# Altium project AMDC.PrjPCB (part 1 of 4)
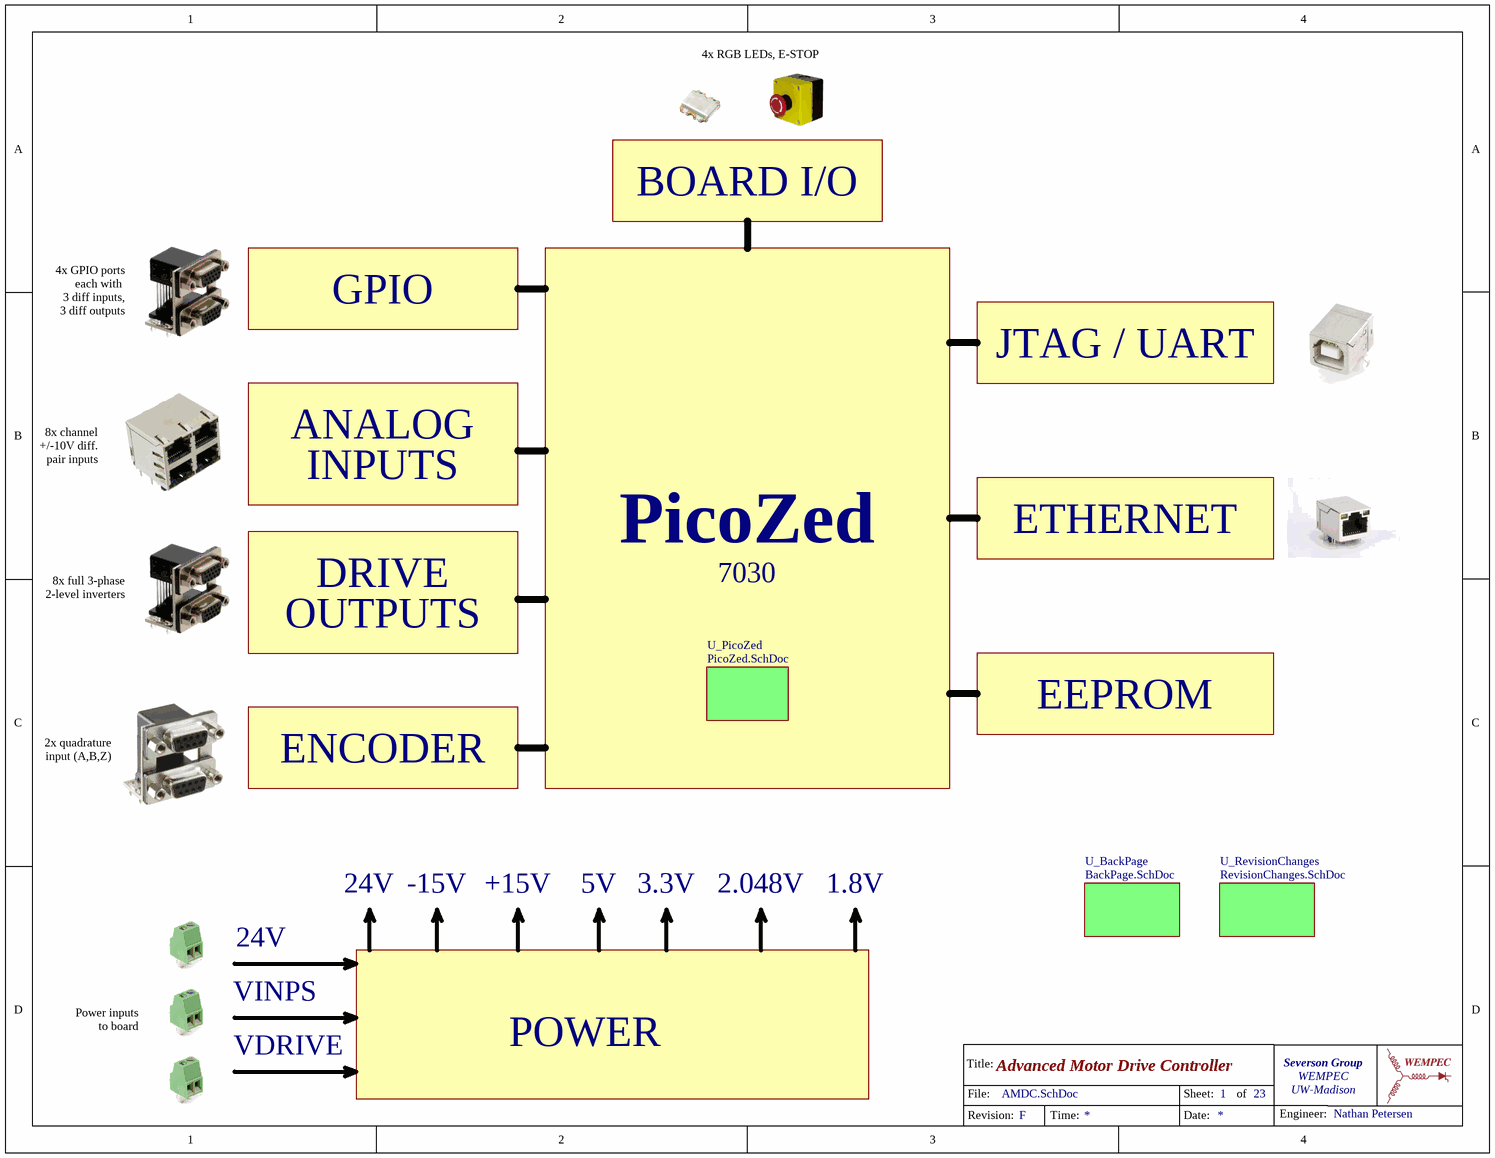
[diagram p0: AMDC.SchDoc]
ProjectGroup: Severson Group; ProjectOrganization: WEMPEC; ProjectRev: F; ProjectUniversity: UW-Madison
23 sheets, 519 parts. Net scope: hierarchical (ports join the sheet entries above them; power ports are global).
Board files: PCB_v4.PcbDoc, PCB_v5.PcbDoc, PCB_v6.PcbDoc
Sheets:
  AMDC.SchDoc
    U_PicoZed = PicoZed.SchDoc
      U_DriveInterface = DriveInterface.SchDoc
        U_InverterConnectors = InverterConnectors.SchDoc
          InverterConnector1AB = InverterConnector.SchDoc
          InverterConnector2AB = InverterConnector.SchDoc
          InverterConnector3AB = InverterConnector.SchDoc
          InverterConnector4AB = InverterConnector.SchDoc
        U_InverterTranslation = InverterTranslation.SchDoc
          U_LVHV8ChanTranslation1 = LVHV8ChanTranslation.SchDoc
          U_LVHV8ChanTranslation2 = LVHV8ChanTranslation.SchDoc
          U_LVHV8ChanTranslation3 = LVHV8ChanTranslation.SchDoc
          U_LVHV8ChanTranslation4 = LVHV8ChanTranslation.SchDoc
          U_LVHV8ChanTranslation5 = LVHV8ChanTranslation.SchDoc
          U_LVHV8ChanTranslation6 = LVHV8ChanTranslation.SchDoc
          U_TranslationStsA = TranslationDir8Chan.SchDoc
          U_TranslationStsB = TranslationDir8Chan.SchDoc
          U_TranslationStsC = TranslationDir8Chan.SchDoc
          U_TranslationStsD = TranslationDir8Chan.SchDoc
      U_AnalogInterface = AnalogInterface.SchDoc
        U_AnalogADC = AnalogADCs.SchDoc
        U_AnalogConnectors = AnalogConnectors.SchDoc
        U_AnalogConditioning = AnalogConditioning.SchDoc
          AnalogSigCond_A = AnalogSigCond.SchDoc
          AnalogSigCond_B = AnalogSigCond.SchDoc
      U_Gb_Ethernet = GbEthernet.SchDoc
      U_Encoder = Encoder.SchDoc
      U_BoardIO = BoardIO.SchDoc
      U_Power = Power.SchDoc
        U_Power_Protection = Power_Protection.SchDoc
        U_Power_InrushLimit = Power_InrushLimit.SchDoc
      U_JTAG_UART = JTAG_UART.SchDoc
      U_GPIO = GPIO.SchDoc
        U_TranslationGPIO_IN_A = TranslationDir8Chan.SchDoc
        U_TranslationGPIO_OUT_A = TranslationDir8Chan.SchDoc
        U_TranslationGPIO_IN_B = TranslationDir8Chan.SchDoc
        U_TranslationGPIO_OUT_B = TranslationDir8Chan.SchDoc
    U_BackPage = BackPage.SchDoc
    U_RevisionChanges = RevisionChanges.SchDoc

## Sheet AMDC.SchDoc: Advanced Motor Drive Controller
size Letter; Engineer: Nathan Petersen; DocumentNumber: 1; Revision: v1.2; SheetNumber: 1; SheetTotal: 23

### Sub-sheets
U_BackPage = BackPage.SchDoc: no entries
U_PicoZed = PicoZed.SchDoc: no entries
U_RevisionChanges = RevisionChanges.SchDoc: no entries

### Notes on the sheet
- 4x RGB LEDs, E-STOP
- BOARD I/O
- GPIO
- 4x GPIO ports
  each with
  3 diff inputs,
  3 diff outputs
- JTAG / UART
- ANALOG
- 8x channel
  +/-10V diff.
  pair inputs
- INPUTS
- DRIVE
- PicoZed
- 7030
- ETHERNET
- 8x full 3-phase
  2-level inverters
- OUTPUTS
- EEPROM
- 2x quadrature
  input (A,B,Z)
- ENCODER
- 24V
- -15V
- +15V
- 5V
- 3.3V
- 2.048V
- 1.8V
- Power inputs
  to board
- VINPS
- VDRIVE
- POWER
- Title:
- File:
- Sheet:
- of
- Revision:
- Time:
- Date:
- Engineer:

## Sheet PicoZed.SchDoc: PicoZed Interface
size 431 x 254 mm; DrawnBy: Nathan Petersen; Engineer: Nathan Petersen; DocumentNumber: 2; Revision: v1.2; SheetNumber: 2; SheetTotal: 23
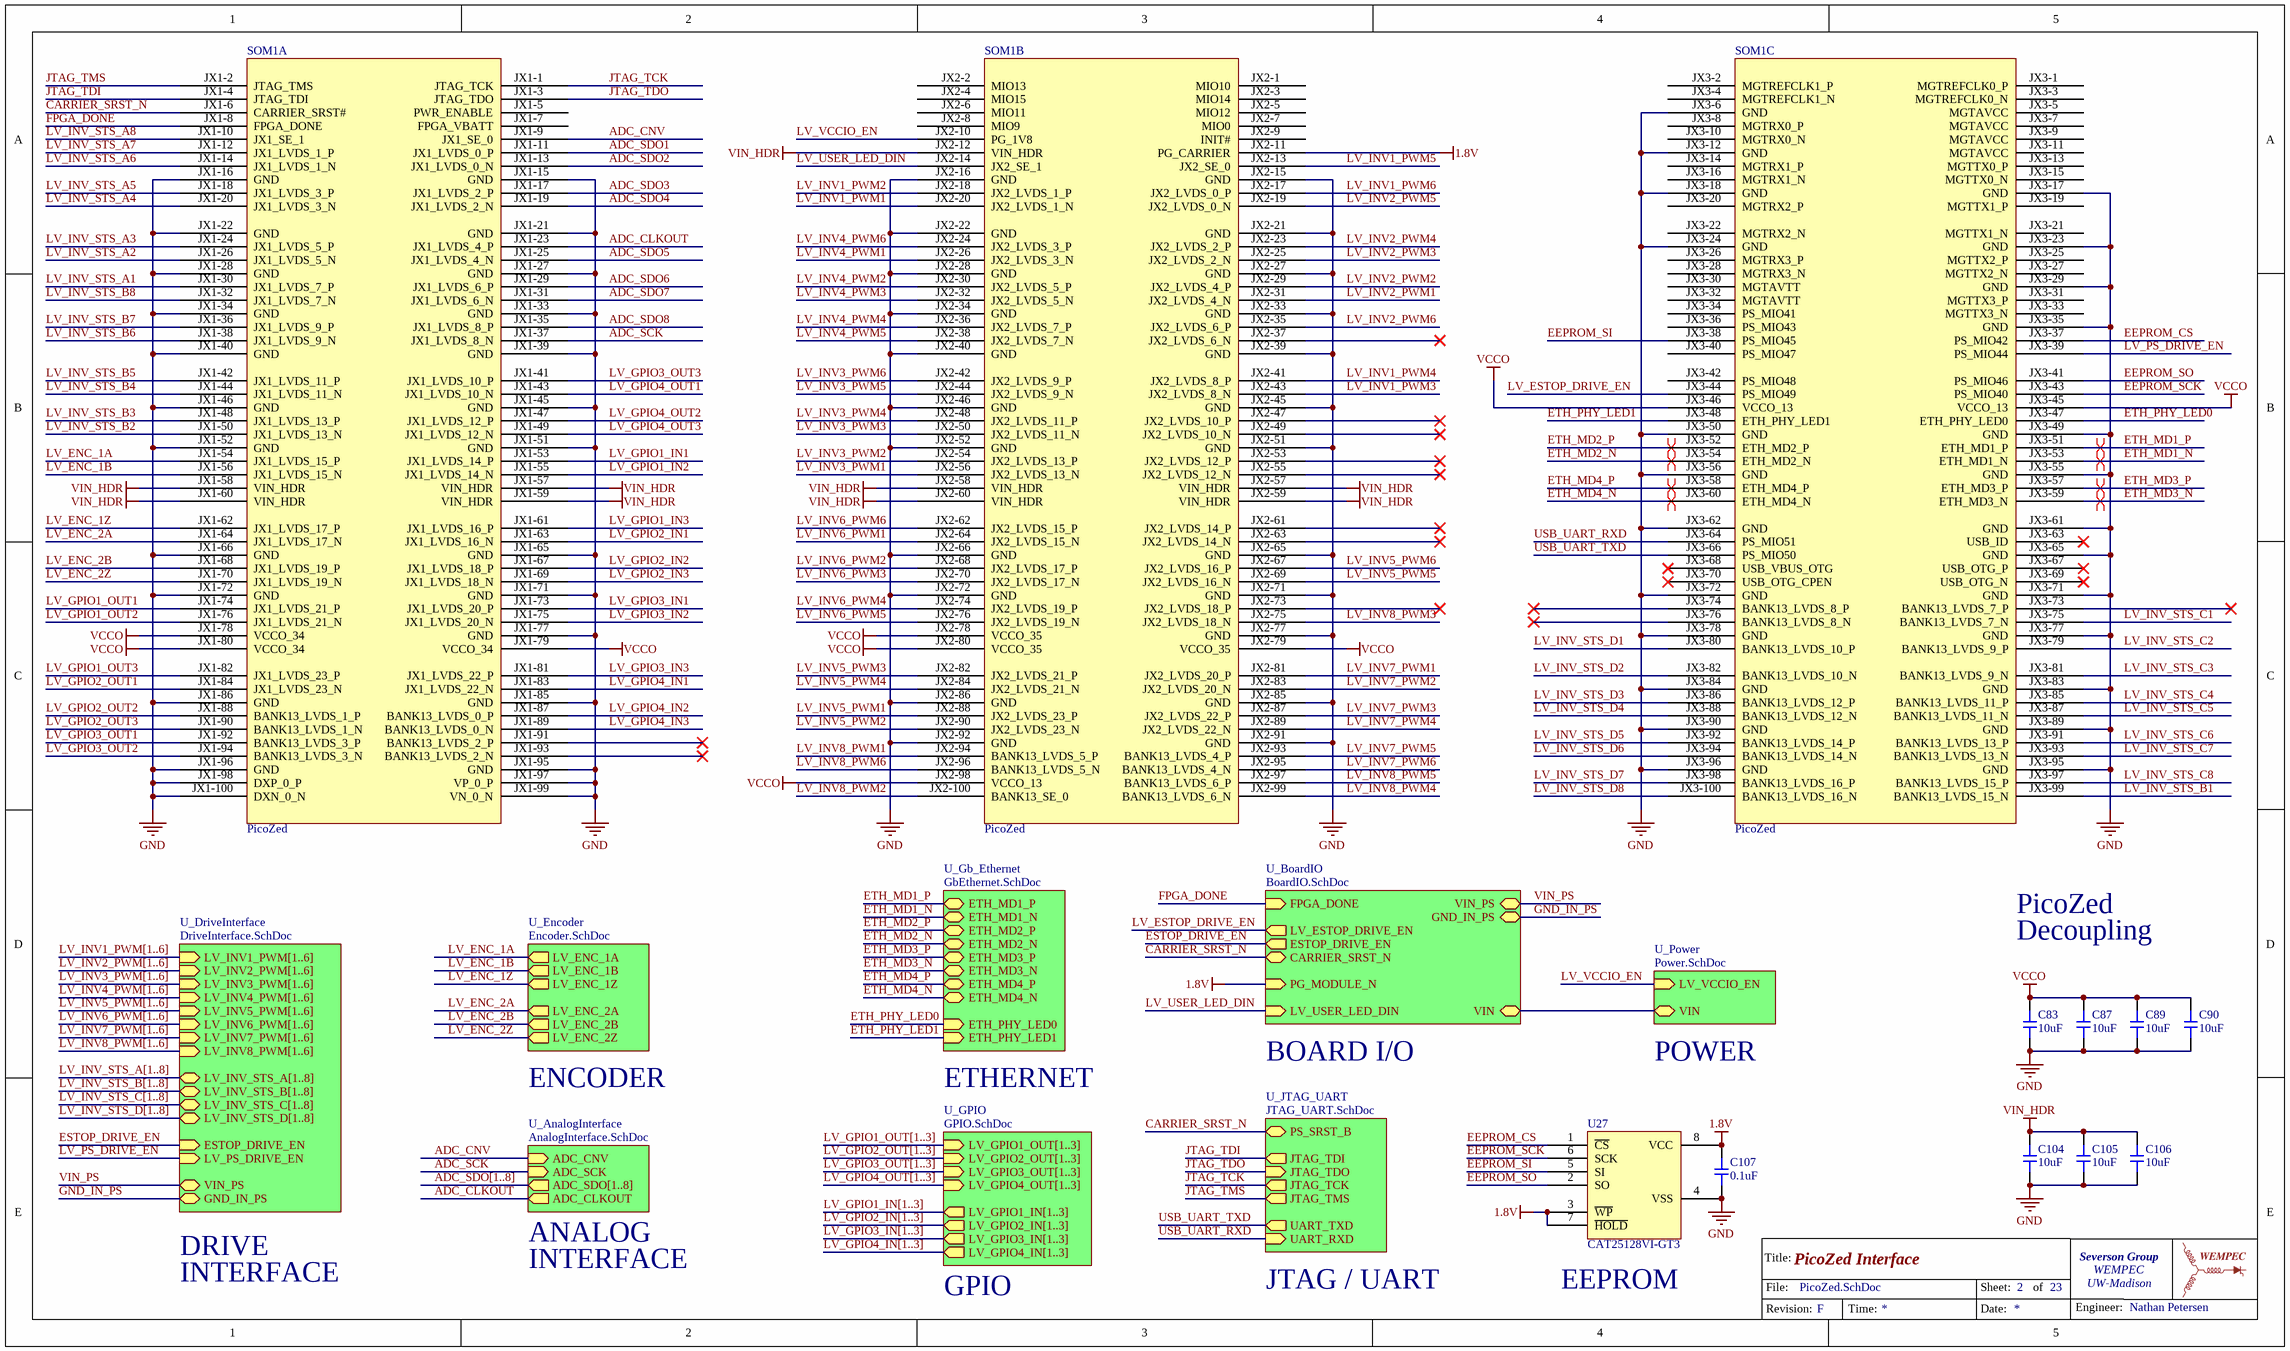
[diagram p1: PicoZed.SchDoc]

### Parts
*  TitleBlockWEMPEC  (value not drawn)  (graphical)
C83  value 10uF  [0603-CAP]  (hidden comment: Capacitor)
C87  value 10uF  [0603-CAP]  (hidden comment: Capacitor)
C89  value 10uF  [0603-CAP]  (hidden comment: Capacitor)
C90  value 10uF  [0603-CAP]  (hidden comment: Capacitor)
C104  value 10uF  [0603-CAP]  (hidden comment: Capacitor)
C105  value 10uF  [0603-CAP]  (hidden comment: Capacitor)
C106  value 10uF  [0603-CAP]  (hidden comment: Capacitor)
C107  value 0.1uF  [0603-CAP]  (hidden comment: Capacitor)
SOM1  PicoZed  [PicoZedSOM]  (parts A,B,C of 3)  (no BOM)
U27  CAT25128VI-GT3  [SOIC127P600X175-8N]

### Sub-sheets
U_AnalogInterface = AnalogInterface.SchDoc: ADC_SDO[1..8] (out), ADC_CNV (in), ADC_SCK (in), ADC_CLKOUT (out)
U_BoardIO = BoardIO.SchDoc: FPGA_DONE (in), ESTOP_DRIVE_EN (out), CARRIER_SRST_N (bidir), PG_MODULE_N (in), LV_USER_LED_DIN (in), LV_ESTOP_DRIVE_EN (out), GND_IN_PS (bidir), VIN_PS (bidir), VIN (bidir)
U_DriveInterface = DriveInterface.SchDoc: LV_INV2_PWM[1..6] (in), LV_INV3_PWM[1..6] (in), LV_INV4_PWM[1..6] (in), LV_INV5_PWM[1..6] (in), LV_INV6_PWM[1..6] (in), LV_INV7_PWM[1..6] (in), LV_INV8_PWM[1..6] (in), LV_INV1_PWM[1..6] (in), ESTOP_DRIVE_EN (in), LV_INV_STS_A[1..8] (bidir), LV_INV_STS_D[1..8] (bidir), LV_INV_STS_C[1..8] (bidir), LV_INV_STS_B[1..8] (bidir), LV_PS_DRIVE_EN (in), GND_IN_PS (bidir), VIN_PS (bidir)
U_Encoder = Encoder.SchDoc: LV_ENC_1A (out), LV_ENC_1B (out), LV_ENC_1Z (out), LV_ENC_2A (out), LV_ENC_2B (out), LV_ENC_2Z (out)
U_Gb_Ethernet = GbEthernet.SchDoc: ETH_MD1_P (bidir), ETH_MD1_N (bidir), ETH_MD2_P (bidir), ETH_MD2_N (bidir), ETH_MD3_P (bidir), ETH_MD3_N (bidir), ETH_MD4_P (bidir), ETH_MD4_N (bidir), ETH_PHY_LED0 (in), ETH_PHY_LED1 (in)
U_GPIO = GPIO.SchDoc: LV_GPIO4_OUT[1..3] (in), LV_GPIO3_OUT[1..3] (in), LV_GPIO1_OUT[1..3] (in), LV_GPIO3_IN[1..3] (out), LV_GPIO2_OUT[1..3] (in), LV_GPIO1_IN[1..3] (out), LV_GPIO2_IN[1..3] (out), LV_GPIO4_IN[1..3] (out)
U_JTAG_UART = JTAG_UART.SchDoc: JTAG_TMS (out), UART_TXD (out), PS_SRST_B (bidir), UART_RXD (in), JTAG_TDI (out), JTAG_TCK (out), JTAG_TDO (in)
U_Power = Power.SchDoc: VIN (bidir), LV_VCCIO_EN (in)

### Nets
1.8V: C107.2 SOM1.JX2-11(PG_CARRIER) U27.3(~{WP}) U27.7(~{HOLD}) U27.8(VCC) ; sheet U_BoardIO/PG_MODULE_N
GND: C83.1 C87.1 C89.1 C90.1 C104.1 C105.1 C106.1 C107.1 SOM1.JX1-15(GND) SOM1.JX1-16(GND) SOM1.JX1-21(GND) SOM1.JX1-22(GND) SOM1.JX1-27(GND) SOM1.JX1-28(GND) SOM1.JX1-33(GND) SOM1.JX1-34(GND) SOM1.JX1-39(GND) SOM1.JX1-40(GND) SOM1.JX1-45(GND) SOM1.JX1-46(GND) SOM1.JX1-51(GND) SOM1.JX1-52(GND) SOM1.JX1-65(GND) SOM1.JX1-66(GND) SOM1.JX1-71(GND) SOM1.JX1-72(GND) SOM1.JX1-77(GND) SOM1.JX1-85(GND) SOM1.JX1-86(GND) SOM1.JX1-95(GND) SOM1.JX1-96(GND) SOM1.JX1-97(VP_0_P) SOM1.JX1-98(DXP_0_P) SOM1.JX1-99(VN_0_N) SOM1.JX1-100(DXN_0_N) SOM1.JX2-15(GND) SOM1.JX2-16(GND) SOM1.JX2-21(GND) SOM1.JX2-22(GND) SOM1.JX2-27(GND) SOM1.JX2-28(GND) SOM1.JX2-33(GND) SOM1.JX2-34(GND) SOM1.JX2-39(GND) SOM1.JX2-40(GND) SOM1.JX2-45(GND) SOM1.JX2-46(GND) SOM1.JX2-51(GND) SOM1.JX2-52(GND) SOM1.JX2-65(GND) SOM1.JX2-66(GND) SOM1.JX2-71(GND) SOM1.JX2-72(GND) SOM1.JX2-77(GND) SOM1.JX2-85(GND) SOM1.JX2-86(GND) SOM1.JX2-91(GND) SOM1.JX2-92(GND) SOM1.JX3-6(GND) SOM1.JX3-12(GND) SOM1.JX3-17(GND) SOM1.JX3-18(GND) SOM1.JX3-23(GND) SOM1.JX3-24(GND) SOM1.JX3-29(GND) SOM1.JX3-35(GND) SOM1.JX3-49(GND) SOM1.JX3-50(GND) SOM1.JX3-55(GND) SOM1.JX3-56(GND) SOM1.JX3-61(GND) SOM1.JX3-62(GND) SOM1.JX3-65(GND) SOM1.JX3-71(GND) SOM1.JX3-72(GND) SOM1.JX3-77(GND) SOM1.JX3-78(GND) SOM1.JX3-83(GND) SOM1.JX3-84(GND) SOM1.JX3-89(GND) SOM1.JX3-90(GND) SOM1.JX3-95(GND) SOM1.JX3-96(GND) U27.4(VSS)
VCCO: C83.2 C87.2 C89.2 C90.2 SOM1.JX1-78(VCCO_34) SOM1.JX1-79(VCCO_34) SOM1.JX1-80(VCCO_34) SOM1.JX2-78(VCCO_35) SOM1.JX2-79(VCCO_35) SOM1.JX2-80(VCCO_35) SOM1.JX2-98(VCCO_13) SOM1.JX3-45(VCCO_13) SOM1.JX3-46(VCCO_13)
VIN_HDR: C104.2 C105.2 C106.2 SOM1.JX1-57(VIN_HDR) SOM1.JX1-58(VIN_HDR) SOM1.JX1-59(VIN_HDR) SOM1.JX1-60(VIN_HDR) SOM1.JX2-12(VIN_HDR) SOM1.JX2-57(VIN_HDR) SOM1.JX2-58(VIN_HDR) SOM1.JX2-59(VIN_HDR) SOM1.JX2-60(VIN_HDR)
ADC_CLKOUT: SOM1.JX1-23(JX1_LVDS_4_P) ; sheet U_AnalogInterface/ADC_CLKOUT
ADC_CNV: SOM1.JX1-9(JX1_SE_0) ; sheet U_AnalogInterface/ADC_CNV
ADC_SCK: SOM1.JX1-37(JX1_LVDS_8_N) ; sheet U_AnalogInterface/ADC_SCK
ADC_SDO1: SOM1.JX1-11(JX1_LVDS_0_P)
ADC_SDO2: SOM1.JX1-13(JX1_LVDS_0_N)
ADC_SDO3: SOM1.JX1-17(JX1_LVDS_2_P)
ADC_SDO4: SOM1.JX1-19(JX1_LVDS_2_N)
ADC_SDO5: SOM1.JX1-25(JX1_LVDS_4_N)
ADC_SDO6: SOM1.JX1-29(JX1_LVDS_6_P)
ADC_SDO7: SOM1.JX1-31(JX1_LVDS_6_N)
ADC_SDO8: SOM1.JX1-35(JX1_LVDS_8_P)
CARRIER_SRST_N: SOM1.JX1-6(CARRIER_SRST#) ; sheet U_BoardIO/CARRIER_SRST_N, sheet U_JTAG_UART/PS_SRST_B
EEPROM_CS: SOM1.JX3-37(PS_MIO42) U27.1(~{CS})
EEPROM_SCK: SOM1.JX3-43(PS_MIO40) U27.6(SCK)
EEPROM_SI: SOM1.JX3-38(PS_MIO45) U27.5(SI)
EEPROM_SO: SOM1.JX3-41(PS_MIO46) U27.2(SO)
ESTOP_DRIVE_EN: sheet U_DriveInterface/ESTOP_DRIVE_EN, sheet U_BoardIO/ESTOP_DRIVE_EN
ETH_MD1_N: SOM1.JX3-53(ETH_MD1_N) ; sheet U_Gb_Ethernet/ETH_MD1_N
ETH_MD1_P: SOM1.JX3-51(ETH_MD1_P) ; sheet U_Gb_Ethernet/ETH_MD1_P
ETH_MD2_N: SOM1.JX3-54(ETH_MD2_N) ; sheet U_Gb_Ethernet/ETH_MD2_N
ETH_MD2_P: SOM1.JX3-52(ETH_MD2_P) ; sheet U_Gb_Ethernet/ETH_MD2_P
ETH_MD3_N: SOM1.JX3-59(ETH_MD3_N) ; sheet U_Gb_Ethernet/ETH_MD3_N
ETH_MD3_P: SOM1.JX3-57(ETH_MD3_P) ; sheet U_Gb_Ethernet/ETH_MD3_P
ETH_MD4_N: SOM1.JX3-60(ETH_MD4_N) ; sheet U_Gb_Ethernet/ETH_MD4_N
ETH_MD4_P: SOM1.JX3-58(ETH_MD4_P) ; sheet U_Gb_Ethernet/ETH_MD4_P
ETH_PHY_LED0: SOM1.JX3-47(ETH_PHY_LED0) ; sheet U_Gb_Ethernet/ETH_PHY_LED0
ETH_PHY_LED1: SOM1.JX3-48(ETH_PHY_LED1) ; sheet U_Gb_Ethernet/ETH_PHY_LED1
FPGA_DONE: SOM1.JX1-8(FPGA_DONE) ; sheet U_BoardIO/FPGA_DONE
GND_IN_PS: sheet U_DriveInterface/GND_IN_PS, sheet U_BoardIO/GND_IN_PS
JTAG_TCK: SOM1.JX1-1(JTAG_TCK) ; sheet U_JTAG_UART/JTAG_TCK
JTAG_TDI: SOM1.JX1-4(JTAG_TDI) ; sheet U_JTAG_UART/JTAG_TDI
JTAG_TDO: SOM1.JX1-3(JTAG_TDO) ; sheet U_JTAG_UART/JTAG_TDO
JTAG_TMS: SOM1.JX1-2(JTAG_TMS) ; sheet U_JTAG_UART/JTAG_TMS
LV_ENC_1A: SOM1.JX1-54(JX1_LVDS_15_P) ; sheet U_Encoder/LV_ENC_1A
LV_ENC_1B: SOM1.JX1-56(JX1_LVDS_15_N) ; sheet U_Encoder/LV_ENC_1B
LV_ENC_1Z: SOM1.JX1-62(JX1_LVDS_17_P) ; sheet U_Encoder/LV_ENC_1Z
LV_ENC_2A: SOM1.JX1-64(JX1_LVDS_17_N) ; sheet U_Encoder/LV_ENC_2A
LV_ENC_2B: SOM1.JX1-68(JX1_LVDS_19_P) ; sheet U_Encoder/LV_ENC_2B
LV_ENC_2Z: SOM1.JX1-70(JX1_LVDS_19_N) ; sheet U_Encoder/LV_ENC_2Z
LV_ESTOP_DRIVE_EN: SOM1.JX3-44(PS_MIO49) ; sheet U_BoardIO/LV_ESTOP_DRIVE_EN
LV_GPIO1_IN1: SOM1.JX1-53(JX1_LVDS_14_P)
LV_GPIO1_IN2: SOM1.JX1-55(JX1_LVDS_14_N)
LV_GPIO1_IN3: SOM1.JX1-61(JX1_LVDS_16_P)
LV_GPIO1_OUT1: SOM1.JX1-74(JX1_LVDS_21_P)
LV_GPIO1_OUT2: SOM1.JX1-76(JX1_LVDS_21_N)
LV_GPIO1_OUT3: SOM1.JX1-82(JX1_LVDS_23_P)
LV_GPIO2_IN1: SOM1.JX1-63(JX1_LVDS_16_N)
LV_GPIO2_IN2: SOM1.JX1-67(JX1_LVDS_18_P)
LV_GPIO2_IN3: SOM1.JX1-69(JX1_LVDS_18_N)
LV_GPIO2_OUT1: SOM1.JX1-84(JX1_LVDS_23_N)
LV_GPIO2_OUT2: SOM1.JX1-88(BANK13_LVDS_1_P)
LV_GPIO2_OUT3: SOM1.JX1-90(BANK13_LVDS_1_N)
LV_GPIO3_IN1: SOM1.JX1-73(JX1_LVDS_20_P)
LV_GPIO3_IN2: SOM1.JX1-75(JX1_LVDS_20_N)
LV_GPIO3_IN3: SOM1.JX1-81(JX1_LVDS_22_P)
LV_GPIO3_OUT1: SOM1.JX1-92(BANK13_LVDS_3_P)
LV_GPIO3_OUT2: SOM1.JX1-94(BANK13_LVDS_3_N)
LV_GPIO3_OUT3: SOM1.JX1-41(JX1_LVDS_10_P)
LV_GPIO4_IN1: SOM1.JX1-83(JX1_LVDS_22_N)
LV_GPIO4_IN2: SOM1.JX1-87(BANK13_LVDS_0_P)
LV_GPIO4_IN3: SOM1.JX1-89(BANK13_LVDS_0_N)
LV_GPIO4_OUT1: SOM1.JX1-43(JX1_LVDS_10_N)
LV_GPIO4_OUT2: SOM1.JX1-47(JX1_LVDS_12_P)
LV_GPIO4_OUT3: SOM1.JX1-49(JX1_LVDS_12_N)
LV_INV1_PWM1: SOM1.JX2-20(JX2_LVDS_1_N)
LV_INV1_PWM2: SOM1.JX2-18(JX2_LVDS_1_P)
LV_INV1_PWM3: SOM1.JX2-43(JX2_LVDS_8_N)
LV_INV1_PWM4: SOM1.JX2-41(JX2_LVDS_8_P)
LV_INV1_PWM5: SOM1.JX2-13(JX2_SE_0)
LV_INV1_PWM6: SOM1.JX2-17(JX2_LVDS_0_P)
LV_INV2_PWM1: SOM1.JX2-31(JX2_LVDS_4_N)
LV_INV2_PWM2: SOM1.JX2-29(JX2_LVDS_4_P)
LV_INV2_PWM3: SOM1.JX2-25(JX2_LVDS_2_N)
LV_INV2_PWM4: SOM1.JX2-23(JX2_LVDS_2_P)
LV_INV2_PWM5: SOM1.JX2-19(JX2_LVDS_0_N)
LV_INV2_PWM6: SOM1.JX2-35(JX2_LVDS_6_P)
LV_INV3_PWM1: SOM1.JX2-56(JX2_LVDS_13_N)
LV_INV3_PWM2: SOM1.JX2-54(JX2_LVDS_13_P)
LV_INV3_PWM3: SOM1.JX2-50(JX2_LVDS_11_N)
LV_INV3_PWM4: SOM1.JX2-48(JX2_LVDS_11_P)
LV_INV3_PWM5: SOM1.JX2-44(JX2_LVDS_9_N)
LV_INV3_PWM6: SOM1.JX2-42(JX2_LVDS_9_P)
LV_INV4_PWM1: SOM1.JX2-26(JX2_LVDS_3_N)
LV_INV4_PWM2: SOM1.JX2-30(JX2_LVDS_5_P)
LV_INV4_PWM3: SOM1.JX2-32(JX2_LVDS_5_N)
LV_INV4_PWM4: SOM1.JX2-36(JX2_LVDS_7_P)
LV_INV4_PWM5: SOM1.JX2-38(JX2_LVDS_7_N)
LV_INV4_PWM6: SOM1.JX2-24(JX2_LVDS_3_P)
LV_INV5_PWM1: SOM1.JX2-88(JX2_LVDS_23_P)
LV_INV5_PWM2: SOM1.JX2-90(JX2_LVDS_23_N)
LV_INV5_PWM3: SOM1.JX2-82(JX2_LVDS_21_P)
LV_INV5_PWM4: SOM1.JX2-84(JX2_LVDS_21_N)
LV_INV5_PWM5: SOM1.JX2-69(JX2_LVDS_16_N)
LV_INV5_PWM6: SOM1.JX2-67(JX2_LVDS_16_P)
LV_INV6_PWM1: SOM1.JX2-64(JX2_LVDS_15_N)
LV_INV6_PWM2: SOM1.JX2-68(JX2_LVDS_17_P)
LV_INV6_PWM3: SOM1.JX2-70(JX2_LVDS_17_N)
LV_INV6_PWM4: SOM1.JX2-74(JX2_LVDS_19_P)
LV_INV6_PWM5: SOM1.JX2-76(JX2_LVDS_19_N)
LV_INV6_PWM6: SOM1.JX2-62(JX2_LVDS_15_P)
LV_INV7_PWM1: SOM1.JX2-81(JX2_LVDS_20_P)
LV_INV7_PWM2: SOM1.JX2-83(JX2_LVDS_20_N)
LV_INV7_PWM3: SOM1.JX2-87(JX2_LVDS_22_P)
LV_INV7_PWM4: SOM1.JX2-89(JX2_LVDS_22_N)
LV_INV7_PWM5: SOM1.JX2-93(BANK13_LVDS_4_P)
LV_INV7_PWM6: SOM1.JX2-95(BANK13_LVDS_4_N)
LV_INV8_PWM1: SOM1.JX2-94(BANK13_LVDS_5_P)
LV_INV8_PWM2: SOM1.JX2-100(BANK13_SE_0)
LV_INV8_PWM3: SOM1.JX2-75(JX2_LVDS_18_N)
LV_INV8_PWM4: SOM1.JX2-99(BANK13_LVDS_6_N)
LV_INV8_PWM5: SOM1.JX2-97(BANK13_LVDS_6_P)
LV_INV8_PWM6: SOM1.JX2-96(BANK13_LVDS_5_N)
LV_INV_STS_A1: SOM1.JX1-30(JX1_LVDS_7_P)
LV_INV_STS_A2: SOM1.JX1-26(JX1_LVDS_5_N)
LV_INV_STS_A3: SOM1.JX1-24(JX1_LVDS_5_P)
LV_INV_STS_A4: SOM1.JX1-20(JX1_LVDS_3_N)
LV_INV_STS_A5: SOM1.JX1-18(JX1_LVDS_3_P)
LV_INV_STS_A6: SOM1.JX1-14(JX1_LVDS_1_N)
LV_INV_STS_A7: SOM1.JX1-12(JX1_LVDS_1_P)
LV_INV_STS_A8: SOM1.JX1-10(JX1_SE_1)
LV_INV_STS_B1: SOM1.JX3-99(BANK13_LVDS_15_N)
LV_INV_STS_B2: SOM1.JX1-50(JX1_LVDS_13_N)
LV_INV_STS_B3: SOM1.JX1-48(JX1_LVDS_13_P)
LV_INV_STS_B4: SOM1.JX1-44(JX1_LVDS_11_N)
LV_INV_STS_B5: SOM1.JX1-42(JX1_LVDS_11_P)
LV_INV_STS_B6: SOM1.JX1-38(JX1_LVDS_9_N)
LV_INV_STS_B7: SOM1.JX1-36(JX1_LVDS_9_P)
LV_INV_STS_B8: SOM1.JX1-32(JX1_LVDS_7_N)
LV_INV_STS_C1: SOM1.JX3-75(BANK13_LVDS_7_N)
LV_INV_STS_C2: SOM1.JX3-79(BANK13_LVDS_9_P)
LV_INV_STS_C3: SOM1.JX3-81(BANK13_LVDS_9_N)
LV_INV_STS_C4: SOM1.JX3-85(BANK13_LVDS_11_P)
LV_INV_STS_C5: SOM1.JX3-87(BANK13_LVDS_11_N)
LV_INV_STS_C6: SOM1.JX3-91(BANK13_LVDS_13_P)
LV_INV_STS_C7: SOM1.JX3-93(BANK13_LVDS_13_N)
LV_INV_STS_C8: SOM1.JX3-97(BANK13_LVDS_15_P)
LV_INV_STS_D1: SOM1.JX3-80(BANK13_LVDS_10_P)
LV_INV_STS_D2: SOM1.JX3-82(BANK13_LVDS_10_N)
LV_INV_STS_D3: SOM1.JX3-86(BANK13_LVDS_12_P)
LV_INV_STS_D4: SOM1.JX3-88(BANK13_LVDS_12_N)
LV_INV_STS_D5: SOM1.JX3-92(BANK13_LVDS_14_P)
LV_INV_STS_D6: SOM1.JX3-94(BANK13_LVDS_14_N)
LV_INV_STS_D7: SOM1.JX3-98(BANK13_LVDS_16_P)
LV_INV_STS_D8: SOM1.JX3-100(BANK13_LVDS_16_N)
LV_PS_DRIVE_EN: SOM1.JX3-39(PS_MIO44) ; sheet U_DriveInterface/LV_PS_DRIVE_EN
LV_USER_LED_DIN: SOM1.JX2-14(JX2_SE_1) ; sheet U_BoardIO/LV_USER_LED_DIN
LV_VCCIO_EN: SOM1.JX2-10(PG_1V8) ; sheet U_Power/LV_VCCIO_EN
USB_UART_RXD: SOM1.JX3-64(PS_MIO51) ; sheet U_JTAG_UART/UART_RXD
USB_UART_TXD: SOM1.JX3-66(PS_MIO50) ; sheet U_JTAG_UART/UART_TXD
VIN: sheet U_BoardIO/VIN, sheet U_Power/VIN
VIN_PS: sheet U_DriveInterface/VIN_PS, sheet U_BoardIO/VIN_PS

Not connected (* = marked no-connect by the designer): SOM1 JX1-5(PWR_ENABLE) JX1-7(FPGA_VBATT) JX1-91(BANK13_LVDS_2_P)* JX1-93(BANK13_LVDS_2_N)* JX2-1(MIO10) JX2-2(MIO13) JX2-3(MIO14) JX2-4(MIO15) JX2-5(MIO12) JX2-6(MIO11) JX2-7(MIO0) JX2-8(MIO9) JX2-9(INIT#) JX2-37(JX2_LVDS_6_N)* JX2-47(JX2_LVDS_10_P)* JX2-49(JX2_LVDS_10_N)* JX2-53(JX2_LVDS_12_P)* JX2-55(JX2_LVDS_12_N)* JX2-61(JX2_LVDS_14_P)* JX2-63(JX2_LVDS_14_N)* JX2-73(JX2_LVDS_18_P)* JX3-1(MGTREFCLK0_P) JX3-2(MGTREFCLK1_P) JX3-3(MGTREFCLK0_N) JX3-4(MGTREFCLK1_N) JX3-5(MGTAVCC) JX3-7(MGTAVCC) JX3-8(MGTRX0_P) JX3-9(MGTAVCC) JX3-10(MGTRX0_N) JX3-11(MGTAVCC) JX3-13(MGTTX0_P) JX3-14(MGTRX1_P) JX3-15(MGTTX0_N) JX3-16(MGTRX1_N) JX3-19(MGTTX1_P) JX3-20(MGTRX2_P) JX3-21(MGTTX1_N) JX3-22(MGTRX2_N) JX3-25(MGTTX2_P) JX3-26(MGTRX3_P) JX3-27(MGTTX2_N) JX3-28(MGTRX3_N) JX3-30(MGTAVTT) JX3-31(MGTTX3_P) JX3-32(MGTAVTT) JX3-33(MGTTX3_N) JX3-34(PS_MIO41) JX3-36(PS_MIO43) JX3-40(PS_MIO47) JX3-42(PS_MIO48) JX3-63(USB_ID)* JX3-67(USB_OTG_P)* JX3-68(USB_VBUS_OTG)* JX3-69(USB_OTG_N)* JX3-70(USB_OTG_CPEN)* JX3-73(BANK13_LVDS_7_P)* JX3-74(BANK13_LVDS_8_P)* JX3-76(BANK13_LVDS_8_N)*

### Buses and harness runs
bus ADC_SDO[1..8] = sheet U_AnalogInterface/ADC_SDO[1..8]
bus LV_GPIO1_IN[1..3] = sheet U_GPIO/LV_GPIO1_IN[1..3]
bus LV_GPIO1_OUT[1..3] = sheet U_GPIO/LV_GPIO1_OUT[1..3]
bus LV_GPIO2_IN[1..3] = sheet U_GPIO/LV_GPIO2_IN[1..3]
bus LV_GPIO2_OUT[1..3] = sheet U_GPIO/LV_GPIO2_OUT[1..3]
bus LV_GPIO3_IN[1..3] = sheet U_GPIO/LV_GPIO3_IN[1..3]
bus LV_GPIO3_OUT[1..3] = sheet U_GPIO/LV_GPIO3_OUT[1..3]
bus LV_GPIO4_IN[1..3] = sheet U_GPIO/LV_GPIO4_IN[1..3]
bus LV_GPIO4_OUT[1..3] = sheet U_GPIO/LV_GPIO4_OUT[1..3]
bus LV_INV1_PWM[1..6] = sheet U_DriveInterface/LV_INV1_PWM[1..6]
bus LV_INV2_PWM[1..6] = sheet U_DriveInterface/LV_INV2_PWM[1..6]
bus LV_INV3_PWM[1..6] = sheet U_DriveInterface/LV_INV3_PWM[1..6]
bus LV_INV4_PWM[1..6] = sheet U_DriveInterface/LV_INV4_PWM[1..6]
bus LV_INV5_PWM[1..6] = sheet U_DriveInterface/LV_INV5_PWM[1..6]
bus LV_INV6_PWM[1..6] = sheet U_DriveInterface/LV_INV6_PWM[1..6]
bus LV_INV7_PWM[1..6] = sheet U_DriveInterface/LV_INV7_PWM[1..6]
bus LV_INV8_PWM[1..6] = sheet U_DriveInterface/LV_INV8_PWM[1..6]
bus LV_INV_STS_A[1..8] = sheet U_DriveInterface/LV_INV_STS_A[1..8]
bus LV_INV_STS_B[1..8] = sheet U_DriveInterface/LV_INV_STS_B[1..8]
bus LV_INV_STS_C[1..8] = sheet U_DriveInterface/LV_INV_STS_C[1..8]
bus LV_INV_STS_D[1..8] = sheet U_DriveInterface/LV_INV_STS_D[1..8]

### Layout directives
differential pair: ETH_MD1_N, ETH_MD1_P, ETH_MD2_N, ETH_MD2_P, ETH_MD3_N, ETH_MD3_P, ETH_MD4_N, ETH_MD4_P

### Notes on the sheet
- PicoZed
- Decoupling
- ENCODER
- ETHERNET
- BOARD I/O
- POWER
- DRIVE
- ANALOG
- INTERFACE
- GPIO
- JTAG / UART
- (near U27) EEPROM
- Title:
- File:
- Sheet:
- of
- Revision:
- Time:
- Date:
- Engineer:
- (in symbol TitleBlockWEMPEC) Title:; File:; Sheet:; of; Engineer:; Revision:; Time:; Date:

### Library data of the parts
SOM1 = PicoZed_SOM: PicoZed SOM Carrier Footprint
U27 = CAT25128VI-GT3: IC EEPROM 128K SPI 20MHZ 8SOIC; Supplier 1: Digi-Key; Supplier Part Number 1: CAT25128VI-GT3OSCT-ND
C83 C87 C89 C90 C104-C107 = Capacitor: Supplier 1: Digi-Key
  C83 C87 C89 C90 C104-C106: Supplier Part Number 1: 1276-1119-6-ND
  C107: Supplier Part Number 1: 1276-1012-6-ND

## Sheet DriveInterface.SchDoc: Drive Interface
size Letter; Engineer: Nathan Petersen; DocumentNumber: 12; Revision: v1.2; SheetNumber: 12; SheetTotal: 23
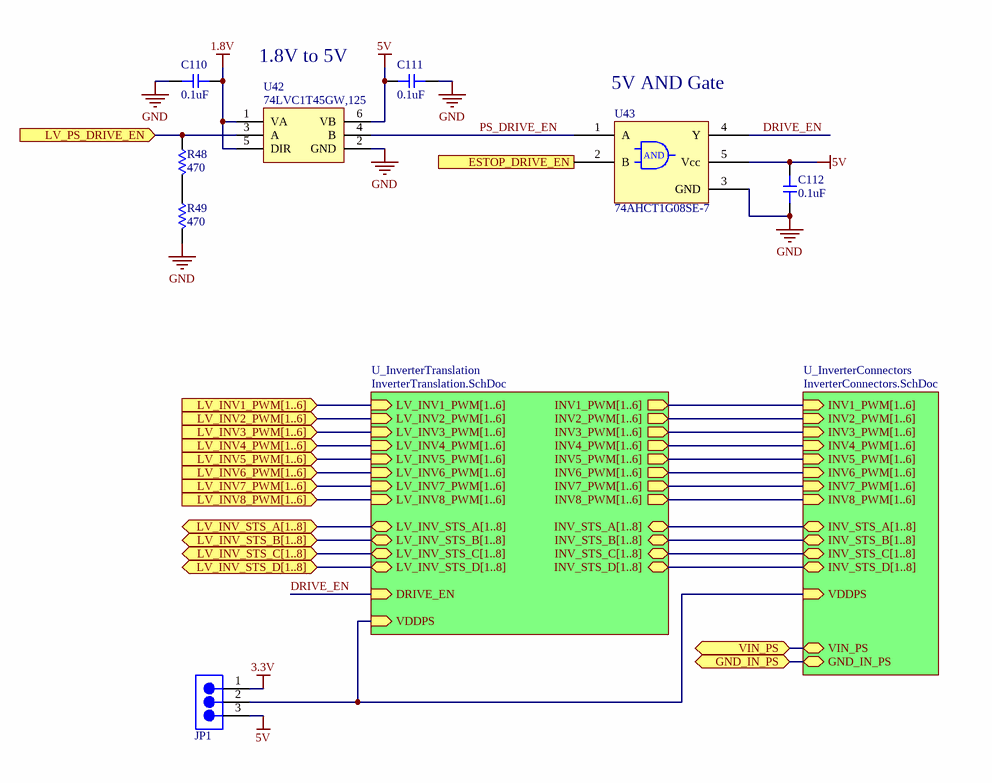
[diagram p2: DriveInterface.SchDoc]

### Parts
C110  value 0.1uF  [0603-CAP]  (hidden comment: Capacitor)
C111  value 0.1uF  [0603-CAP]  (hidden comment: Capacitor)
C112  value 0.1uF  [0603-CAP]  (hidden comment: Capacitor)
JP1  Jumper3  [PIN_HEADER_1X3]  (value not drawn)
R48  value 470  [0603-RES]  (hidden comment: Resistor)
R49  value 470  [0603-RES]  (hidden comment: Resistor)
U42  74LVC1T45GW,125  [SOT65P210X110-6N]
U43  74AHCT1G08SE-7  [SOT65P210X110-5N]

### Sub-sheets
U_InverterConnectors = InverterConnectors.SchDoc: INV1_PWM[1..6] (in), INV3_PWM[1..6] (in), INV4_PWM[1..6] (in), INV5_PWM[1..6] (in), INV6_PWM[1..6] (in), INV7_PWM[1..6] (in), INV8_PWM[1..6] (in), INV2_PWM[1..6] (in), INV_STS_A[1..8] (bidir), INV_STS_C[1..8] (bidir), INV_STS_B[1..8] (bidir), INV_STS_D[1..8] (bidir), VDDPS (in), GND_IN_PS (bidir), VIN_PS (bidir)
U_InverterTranslation = InverterTranslation.SchDoc: LV_INV2_PWM[1..6] (in), LV_INV3_PWM[1..6] (in), LV_INV4_PWM[1..6] (in), LV_INV5_PWM[1..6] (in), LV_INV6_PWM[1..6] (in), LV_INV7_PWM[1..6] (in), LV_INV8_PWM[1..6] (in), LV_INV1_PWM[1..6] (in), DRIVE_EN (in), LV_INV_STS_A[1..8] (bidir), LV_INV_STS_D[1..8] (bidir), LV_INV_STS_C[1..8] (bidir), LV_INV_STS_B[1..8] (bidir), INV2_PWM[1..6] (out), INV3_PWM[1..6] (out), INV4_PWM[1..6] (out), INV5_PWM[1..6] (out), INV6_PWM[1..6] (out), INV7_PWM[1..6] (out), INV8_PWM[1..6] (out), INV1_PWM[1..6] (out), INV_STS_A[1..8] (bidir), INV_STS_B[1..8] (bidir), INV_STS_D[1..8] (bidir), INV_STS_C[1..8] (bidir), VDDPS (in)

### Ports
ESTOP_DRIVE_EN (in), GND_IN_PS (bidir), LV_INV1_PWM[1..6] (in), LV_INV2_PWM[1..6] (in), LV_INV3_PWM[1..6] (in), LV_INV4_PWM[1..6] (in), LV_INV5_PWM[1..6] (in), LV_INV6_PWM[1..6] (in), LV_INV7_PWM[1..6] (in), LV_INV8_PWM[1..6] (in), LV_INV_STS_A[1..8] (bidir), LV_INV_STS_B[1..8] (bidir), LV_INV_STS_C[1..8] (bidir), LV_INV_STS_D[1..8] (bidir), LV_PS_DRIVE_EN (in), VIN_PS (bidir)

### Nets
1.8V: C110.2 U42.1(VA) U42.5(DIR)
3.3V: JP1.1
5V: C111.1 C112.2 JP1.3 U42.6(VB) U43.5(Vcc)
GND: C110.1 C111.2 C112.1 R49.2 U42.2(GND) U43.3(GND)
DRIVE_EN: U43.4(Y) ; sheet U_InverterTranslation/DRIVE_EN
ESTOP_DRIVE_EN: U43.2(B) ; port ESTOP_DRIVE_EN
GND_IN_PS: port GND_IN_PS, sheet U_InverterConnectors/GND_IN_PS
LV_PS_DRIVE_EN: R48.1 U42.3(A) ; port LV_PS_DRIVE_EN
PS_DRIVE_EN: U42.4(B) U43.1(A)
VDDPS: JP1.2 ; sheet U_InverterConnectors/VDDPS, sheet U_InverterTranslation/VDDPS
VIN_PS: port VIN_PS, sheet U_InverterConnectors/VIN_PS
NetR48_2: R48.2 R49.1

### Buses and harness runs
bus port LV_INV1_PWM[1..6] = sheet U_InverterTranslation/LV_INV1_PWM[1..6]
bus port LV_INV2_PWM[1..6] = sheet U_InverterTranslation/LV_INV2_PWM[1..6]
bus port LV_INV3_PWM[1..6] = sheet U_InverterTranslation/LV_INV3_PWM[1..6]
bus port LV_INV4_PWM[1..6] = sheet U_InverterTranslation/LV_INV4_PWM[1..6]
bus port LV_INV5_PWM[1..6] = sheet U_InverterTranslation/LV_INV5_PWM[1..6]
bus port LV_INV6_PWM[1..6] = sheet U_InverterTranslation/LV_INV6_PWM[1..6]
bus port LV_INV7_PWM[1..6] = sheet U_InverterTranslation/LV_INV7_PWM[1..6]
bus port LV_INV8_PWM[1..6] = sheet U_InverterTranslation/LV_INV8_PWM[1..6]
bus port LV_INV_STS_A[1..8] = sheet U_InverterTranslation/LV_INV_STS_A[1..8]
bus port LV_INV_STS_B[1..8] = sheet U_InverterTranslation/LV_INV_STS_B[1..8]
bus port LV_INV_STS_C[1..8] = sheet U_InverterTranslation/LV_INV_STS_C[1..8]
bus port LV_INV_STS_D[1..8] = sheet U_InverterTranslation/LV_INV_STS_D[1..8]
bus sheet U_InverterConnectors/INV1_PWM[1..6] = sheet U_InverterTranslation/INV1_PWM[1..6]
bus sheet U_InverterConnectors/INV2_PWM[1..6] = sheet U_InverterTranslation/INV2_PWM[1..6]
bus sheet U_InverterConnectors/INV3_PWM[1..6] = sheet U_InverterTranslation/INV3_PWM[1..6]
bus sheet U_InverterConnectors/INV4_PWM[1..6] = sheet U_InverterTranslation/INV4_PWM[1..6]
bus sheet U_InverterConnectors/INV5_PWM[1..6] = sheet U_InverterTranslation/INV5_PWM[1..6]
bus sheet U_InverterConnectors/INV6_PWM[1..6] = sheet U_InverterTranslation/INV6_PWM[1..6]
bus sheet U_InverterConnectors/INV7_PWM[1..6] = sheet U_InverterTranslation/INV7_PWM[1..6]
bus sheet U_InverterConnectors/INV8_PWM[1..6] = sheet U_InverterTranslation/INV8_PWM[1..6]
bus sheet U_InverterConnectors/INV_STS_A[1..8] = sheet U_InverterTranslation/INV_STS_A[1..8]
bus sheet U_InverterConnectors/INV_STS_B[1..8] = sheet U_InverterTranslation/INV_STS_B[1..8]
bus sheet U_InverterConnectors/INV_STS_C[1..8] = sheet U_InverterTranslation/INV_STS_C[1..8]
bus sheet U_InverterConnectors/INV_STS_D[1..8] = sheet U_InverterTranslation/INV_STS_D[1..8]

### Notes on the sheet
- 1.8V to 5V
- (near U43) 5V AND Gate
- Title:
- File:
- Sheet:
- of
- Revision:
- Time:
- Date:
- Engineer:
- (in symbol 74AHCT1G08SE-7) AND

### Library data of the parts
U42 = 74LVC1T45GW,125: TXRX XLATING DUAL 3ST 6TSSOP; Supplier 1: Digi-Key; Supplier Part Number 1: 1727-4560-1-ND
U43 = 74AHCT1G08SE-7: IC GATE AND 1CH 2-INP SOT353; Supplier 1: Digi-Key; Supplier Part Number 1: 74AHCT1G08SE-7DICT-ND
C110-C112 = Capacitor: Supplier 1: Digi-Key; Supplier Part Number 1: 1276-1012-6-ND
JP1 = Jumper3: Supplier 1: Digi-Key; Supplier Part Number 1: 732-5316-ND
R48 R49 = Resistor: Supplier 1: Digi-Key; Supplier Part Number 1: 311-470LDCT-ND

## Sheet InverterConnectors.SchDoc: Inverter Connectors
size Letter; Engineer: Nathan Petersen; DocumentNumber: 16; Revision: v1.2; SheetNumber: 16; SheetTotal: 23
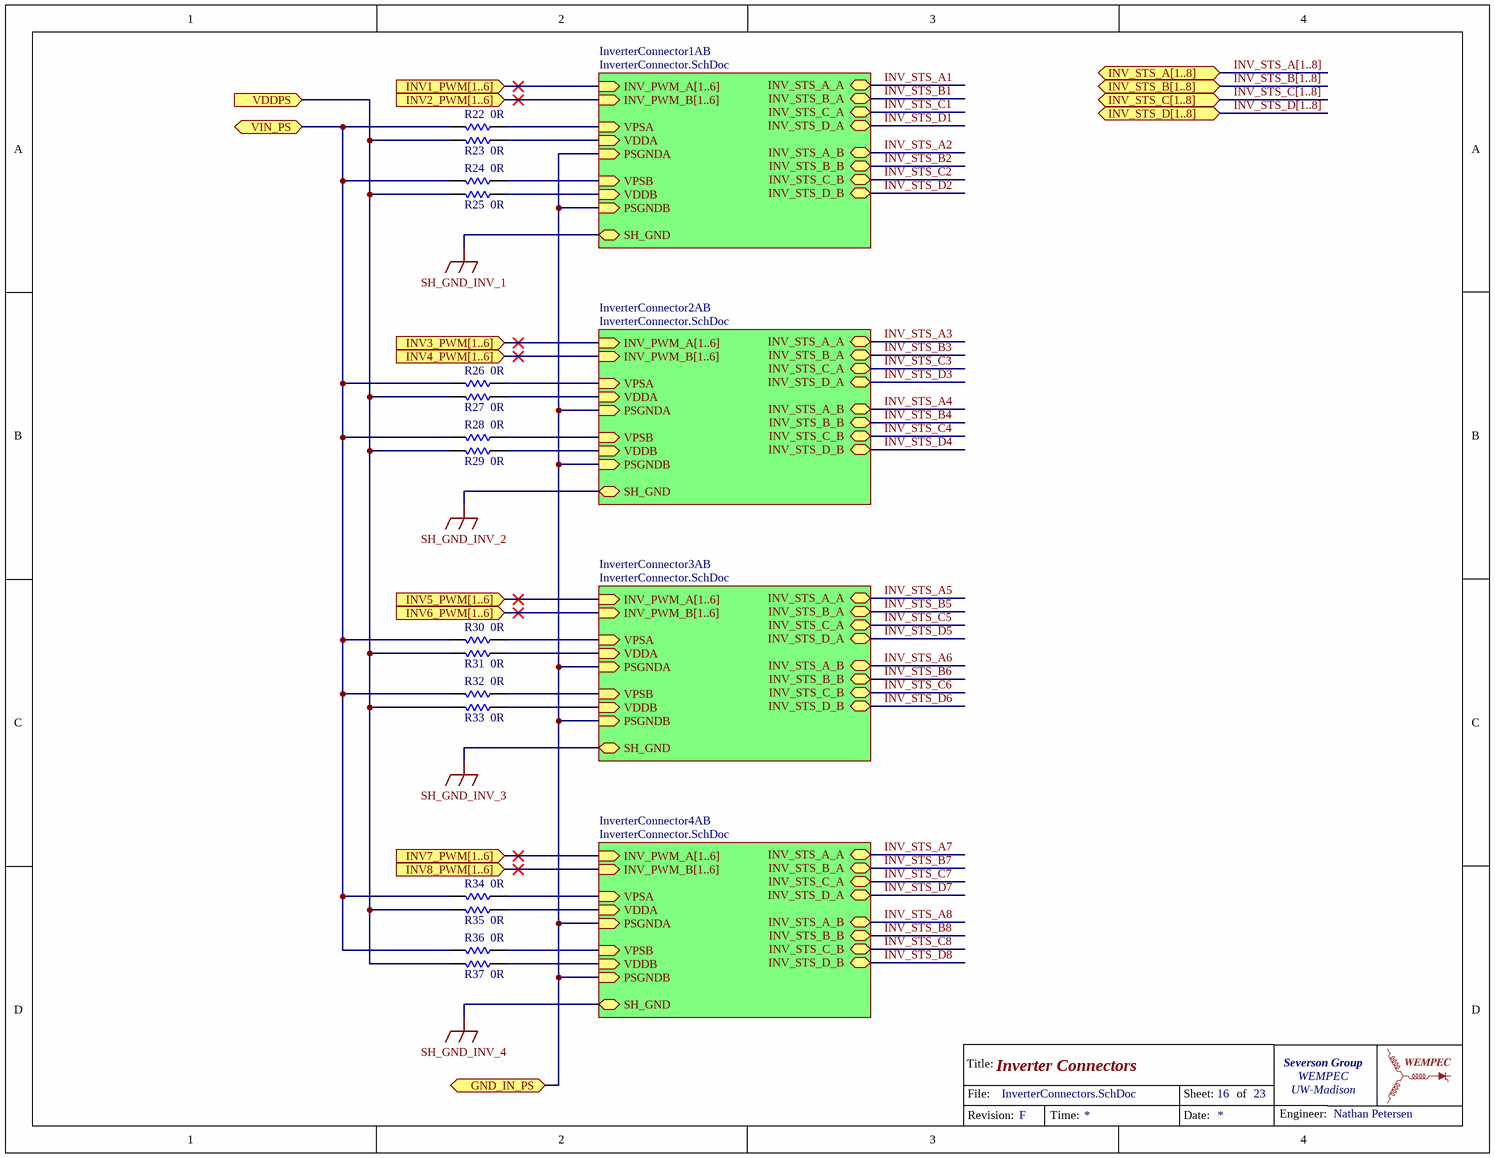
[diagram p3: InverterConnectors.SchDoc]

### Parts
R22  value 0R  [1206-RES]  (hidden comment: Resistor)
R23  value 0R  [1206-RES]  (hidden comment: Resistor)
R24  value 0R  [1206-RES]  (hidden comment: Resistor)
R25  value 0R  [1206-RES]  (hidden comment: Resistor)
R26  value 0R  [1206-RES]  (hidden comment: Resistor)
R27  value 0R  [1206-RES]  (hidden comment: Resistor)
R28  value 0R  [1206-RES]  (hidden comment: Resistor)
R29  value 0R  [1206-RES]  (hidden comment: Resistor)
R30  value 0R  [1206-RES]  (hidden comment: Resistor)
R31  value 0R  [1206-RES]  (hidden comment: Resistor)
R32  value 0R  [1206-RES]  (hidden comment: Resistor)
R33  value 0R  [1206-RES]  (hidden comment: Resistor)
R34  value 0R  [1206-RES]  (hidden comment: Resistor)
R35  value 0R  [1206-RES]  (hidden comment: Resistor)
R36  value 0R  [1206-RES]  (hidden comment: Resistor)
R37  value 0R  [1206-RES]  (hidden comment: Resistor)

### Sub-sheets
InverterConnector1AB = InverterConnector.SchDoc: INV_PWM_A[1..6] (in), INV_PWM_B[1..6] (in), SH_GND (bidir), INV_STS_A_B (bidir), INV_STS_A_A (bidir), INV_STS_B_A (bidir), INV_STS_C_A (bidir), INV_STS_D_A (bidir), INV_STS_B_B (bidir), INV_STS_C_B (bidir), INV_STS_D_B (bidir), VPSA (in), VDDA (in), PSGNDA (in), VPSB (in), VDDB (in), PSGNDB (in)
InverterConnector2AB = InverterConnector.SchDoc: INV_PWM_A[1..6] (in), INV_PWM_B[1..6] (in), SH_GND (bidir), INV_STS_A_B (bidir), INV_STS_A_A (bidir), INV_STS_B_A (bidir), INV_STS_C_A (bidir), INV_STS_D_A (bidir), INV_STS_B_B (bidir), INV_STS_C_B (bidir), INV_STS_D_B (bidir), VPSA (in), VDDA (in), PSGNDA (in), VPSB (in), VDDB (in), PSGNDB (in)
InverterConnector3AB = InverterConnector.SchDoc: INV_PWM_A[1..6] (in), INV_PWM_B[1..6] (in), SH_GND (bidir), INV_STS_A_B (bidir), INV_STS_A_A (bidir), INV_STS_B_A (bidir), INV_STS_C_A (bidir), INV_STS_D_A (bidir), INV_STS_B_B (bidir), INV_STS_C_B (bidir), INV_STS_D_B (bidir), VPSA (in), VDDA (in), PSGNDA (in), VPSB (in), VDDB (in), PSGNDB (in)
InverterConnector4AB = InverterConnector.SchDoc: INV_PWM_A[1..6] (in), INV_PWM_B[1..6] (in), SH_GND (bidir), INV_STS_A_B (bidir), INV_STS_A_A (bidir), INV_STS_B_A (bidir), INV_STS_C_A (bidir), INV_STS_D_A (bidir), INV_STS_B_B (bidir), INV_STS_C_B (bidir), INV_STS_D_B (bidir), VPSA (in), VDDA (in), PSGNDA (in), VPSB (in), VDDB (in), PSGNDB (in)

### Ports
GND_IN_PS (bidir), INV1_PWM[1..6] (in), INV2_PWM[1..6] (in), INV3_PWM[1..6] (in), INV4_PWM[1..6] (in), INV5_PWM[1..6] (in), INV6_PWM[1..6] (in), INV7_PWM[1..6] (in), INV8_PWM[1..6] (in), INV_STS_A[1..8] (bidir), INV_STS_B[1..8] (bidir), INV_STS_C[1..8] (bidir), INV_STS_D[1..8] (bidir), VDDPS (in), VIN_PS (bidir)

### Nets
GND_IN_PS: port GND_IN_PS, sheet InverterConnector1AB/PSGNDA, sheet InverterConnector1AB/PSGNDB, sheet InverterConnector2AB/PSGNDA, sheet InverterConnector2AB/PSGNDB, sheet InverterConnector3AB/PSGNDA, sheet InverterConnector3AB/PSGNDB, sheet InverterConnector4AB/PSGNDA, sheet InverterConnector4AB/PSGNDB
VDDPS: R23.2 R25.2 R27.2 R29.2 R31.2 R33.2 R35.2 R37.2 ; port VDDPS
VIN_PS: R22.2 R24.2 R26.2 R28.2 R30.2 R32.2 R34.2 R36.2 ; port VIN_PS
NetCON10A_12A: R22.1 ; sheet InverterConnector1AB/VPSA
NetCON10A_12B: R24.1 ; sheet InverterConnector1AB/VPSB
NetCON10A_13A: R23.1 ; sheet InverterConnector1AB/VDDA
NetCON10A_13B: R25.1 ; sheet InverterConnector1AB/VDDB
NetCON10B_12A: R26.1 ; sheet InverterConnector2AB/VPSA
NetCON10B_12B: R28.1 ; sheet InverterConnector2AB/VPSB
NetCON10B_13A: R27.1 ; sheet InverterConnector2AB/VDDA
NetCON10B_13B: R29.1 ; sheet InverterConnector2AB/VDDB
NetCON10C_12A: R30.1 ; sheet InverterConnector3AB/VPSA
NetCON10C_12B: R32.1 ; sheet InverterConnector3AB/VPSB
NetCON10C_13A: R31.1 ; sheet InverterConnector3AB/VDDA
NetCON10C_13B: R33.1 ; sheet InverterConnector3AB/VDDB
NetCON10D_12A: R34.1 ; sheet InverterConnector4AB/VPSA
NetCON10D_12B: R36.1 ; sheet InverterConnector4AB/VPSB
NetCON10D_13A: R35.1 ; sheet InverterConnector4AB/VDDA
NetCON10D_13B: R37.1 ; sheet InverterConnector4AB/VDDB

### Buses and harness runs
bus INV_STS_A[1..8] = port INV_STS_A[1..8]
bus INV_STS_B[1..8] = port INV_STS_B[1..8]
bus INV_STS_C[1..8] = port INV_STS_C[1..8]
bus INV_STS_D[1..8] = port INV_STS_D[1..8]
bus port INV1_PWM[1..6] = sheet InverterConnector1AB/INV_PWM_A[1..6]
bus port INV2_PWM[1..6] = sheet InverterConnector1AB/INV_PWM_B[1..6]
bus port INV3_PWM[1..6] = sheet InverterConnector2AB/INV_PWM_A[1..6]
bus port INV4_PWM[1..6] = sheet InverterConnector2AB/INV_PWM_B[1..6]
bus port INV5_PWM[1..6] = sheet InverterConnector3AB/INV_PWM_A[1..6]
bus port INV6_PWM[1..6] = sheet InverterConnector3AB/INV_PWM_B[1..6]
bus port INV7_PWM[1..6] = sheet InverterConnector4AB/INV_PWM_A[1..6]
bus port INV8_PWM[1..6] = sheet InverterConnector4AB/INV_PWM_B[1..6]

### Notes on the sheet
- Title:
- File:
- Sheet:
- of
- Revision:
- Time:
- Date:
- Engineer:

### Library data of the parts
R22-R37 = Resistor: Supplier 1: Digi-Key; Supplier Part Number 1: 311-0.0ERCT-ND

## Sheet InverterConnector.SchDoc: Inverter Connector
size Letter; Engineer: Nathan Petersen; DocumentNumber: 17; Revision: v1.2; SheetNumber: 17; SheetTotal: 23
Used 4 times, as channels U_PicoZed/U_DriveInterface/U_InverterConnectors/InverterConnector1AB, U_PicoZed/U_DriveInterface/U_InverterConnectors/InverterConnector2AB, U_PicoZed/U_DriveInterface/U_InverterConnectors/InverterConnector3AB, U_PicoZed/U_DriveInterface/U_InverterConnectors/InverterConnector4AB. Parts and nets are listed once, with the designators drawn on the sheet.
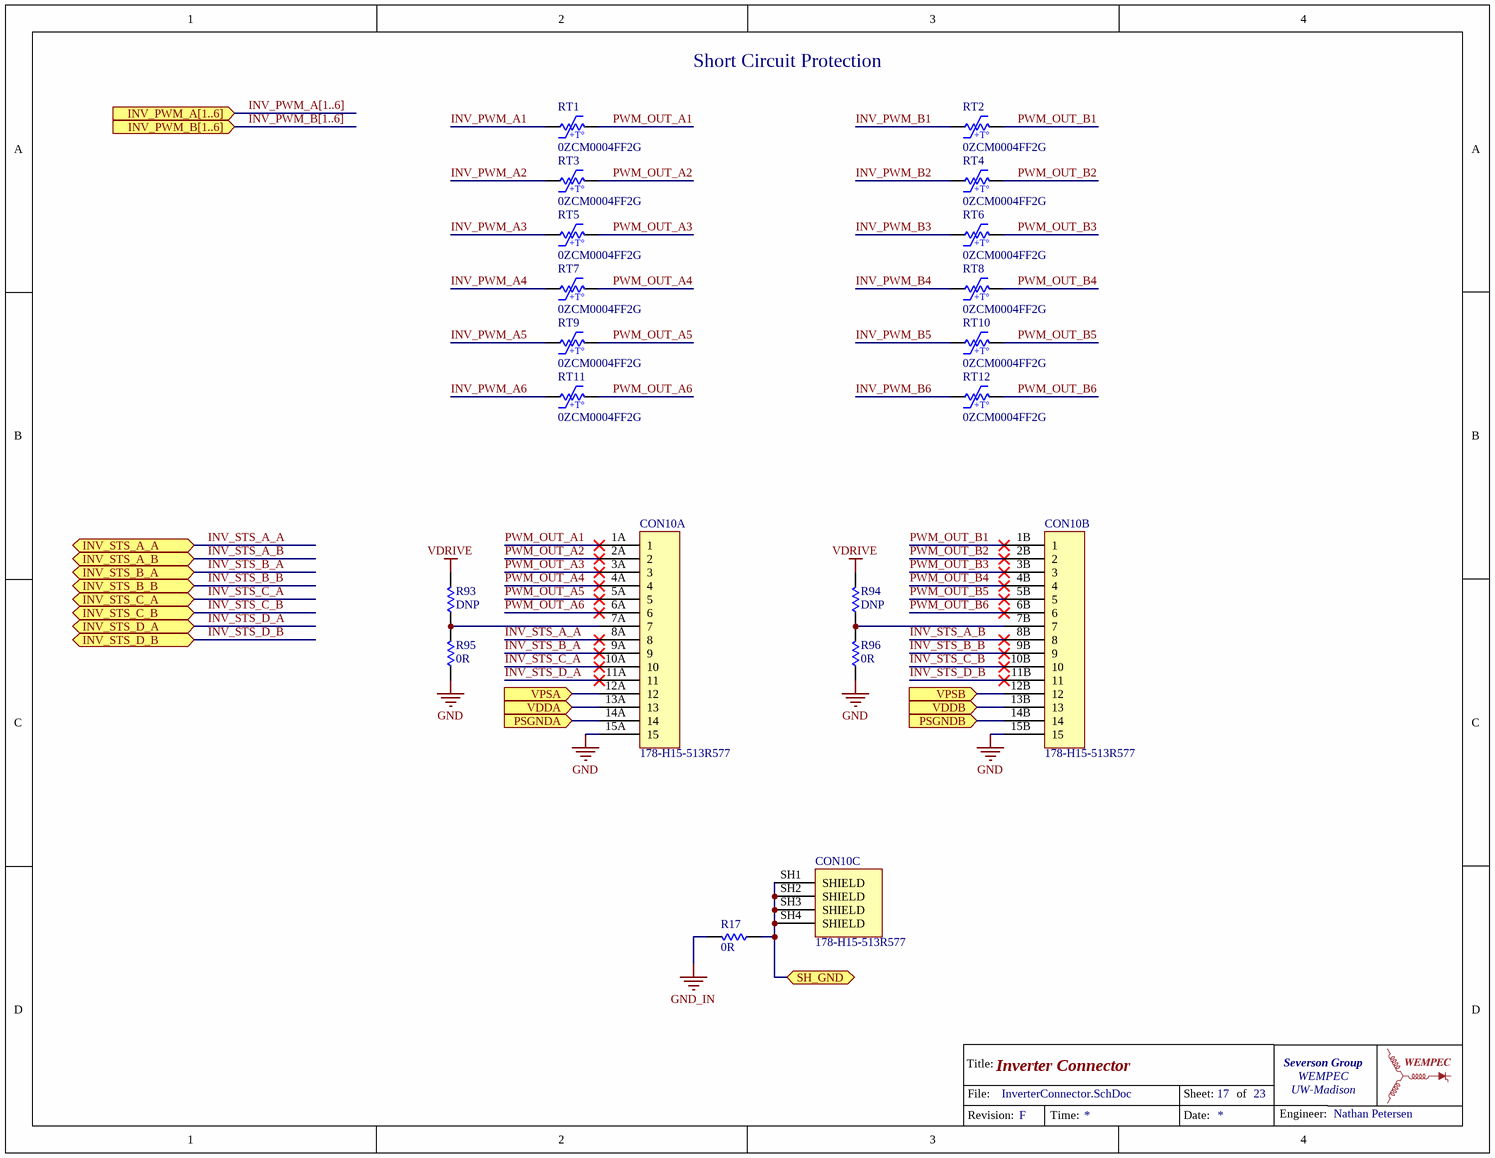
[diagram p4: InverterConnector.SchDoc]

### Parts
CON10  178-H15-513R577  [178-H15-513R577]  (parts A,B,C of 3)
R17  value 0R  [1206-RES]  (hidden comment: Resistor)
R93  value DNP  [1206-RES]  (hidden comment: Resistor)
R94  value DNP  [1206-RES]  (hidden comment: Resistor)
R95  value 0R  [1206-RES]  (hidden comment: Resistor)
R96  value 0R  [1206-RES]  (hidden comment: Resistor)
RT1  0ZCM0004FF2G  [PTCC1607X06N]
RT2  0ZCM0004FF2G  [PTCC1607X06N]
RT3  0ZCM0004FF2G  [PTCC1607X06N]
RT4  0ZCM0004FF2G  [PTCC1607X06N]
RT5  0ZCM0004FF2G  [PTCC1607X06N]
RT6  0ZCM0004FF2G  [PTCC1607X06N]
RT7  0ZCM0004FF2G  [PTCC1607X06N]
RT8  0ZCM0004FF2G  [PTCC1607X06N]
RT9  0ZCM0004FF2G  [PTCC1607X06N]
RT10  0ZCM0004FF2G  [PTCC1607X06N]
RT11  0ZCM0004FF2G  [PTCC1607X06N]
RT12  0ZCM0004FF2G  [PTCC1607X06N]

### Ports
INV_PWM_A[1..6] (in), INV_PWM_B[1..6] (in), INV_STS_A_A (bidir), INV_STS_A_B (bidir), INV_STS_B_A (bidir), INV_STS_B_B (bidir), INV_STS_C_A (bidir), INV_STS_C_B (bidir), INV_STS_D_A (bidir), INV_STS_D_B (bidir), PSGNDA (in), PSGNDB (in), SH_GND (bidir), VDDA (in), VDDB (in), VPSA (in), VPSB (in)

### Nets
GND: CON10.15A(15) CON10.15B(15) R95.1 R96.1
GND_IN: R17.2
VDRIVE: R93.2 R94.2
INV_PWM_A1: RT1.1
INV_PWM_A2: RT3.1
INV_PWM_A3: RT5.1
INV_PWM_A4: RT7.1
INV_PWM_A5: RT9.1
INV_PWM_A6: RT11.1
INV_PWM_B1: RT2.1
INV_PWM_B2: RT4.1
INV_PWM_B3: RT6.1
INV_PWM_B4: RT8.1
INV_PWM_B5: RT10.1
INV_PWM_B6: RT12.1
INV_STS_A_A: CON10.8A(8) ; port INV_STS_A_A
INV_STS_A_B: CON10.8B(8) ; port INV_STS_A_B
INV_STS_B_A: CON10.9A(9) ; port INV_STS_B_A
INV_STS_B_B: CON10.9B(9) ; port INV_STS_B_B
INV_STS_C_A: CON10.10A(10) ; port INV_STS_C_A
INV_STS_C_B: CON10.10B(10) ; port INV_STS_C_B
INV_STS_D_A: CON10.11A(11) ; port INV_STS_D_A
INV_STS_D_B: CON10.11B(11) ; port INV_STS_D_B
PSGNDA: CON10.14A(14) ; port PSGNDA
PSGNDB: CON10.14B(14) ; port PSGNDB
PWM_OUT_A1: CON10.1A(1) RT1.2
PWM_OUT_A2: CON10.2A(2) RT3.2
PWM_OUT_A3: CON10.3A(3) RT5.2
PWM_OUT_A4: CON10.4A(4) RT7.2
PWM_OUT_A5: CON10.5A(5) RT9.2
PWM_OUT_A6: CON10.6A(6) RT11.2
PWM_OUT_B1: CON10.1B(1) RT2.2
PWM_OUT_B2: CON10.2B(2) RT4.2
PWM_OUT_B3: CON10.3B(3) RT6.2
PWM_OUT_B4: CON10.4B(4) RT8.2
PWM_OUT_B5: CON10.5B(5) RT10.2
PWM_OUT_B6: CON10.6B(6) RT12.2
SH_GND: CON10.SH1(SHIELD) CON10.SH2(SHIELD) CON10.SH3(SHIELD) CON10.SH4(SHIELD) R17.1 ; port SH_GND
VDDA: CON10.13A(13) ; port VDDA
VDDB: CON10.13B(13) ; port VDDB
VPSA: CON10.12A(12) ; port VPSA
VPSB: CON10.12B(12) ; port VPSB
NetCON10_7A: CON10.7A(7) R93.1 R95.2
NetCON10_7B: CON10.7B(7) R94.1 R96.2

### Channels
U_PicoZed/U_DriveInterface/U_InverterConnectors/InverterConnector1AB: designators end in A; ports INV_STS_A_A=INV_STS_A1 INV_STS_A_B=INV_STS_A2 INV_STS_B_A=INV_STS_B1 INV_STS_B_B=INV_STS_B2 INV_STS_C_A=INV_STS_C1 INV_STS_C_B=INV_STS_C2 INV_STS_D_A=INV_STS_D1 INV_STS_D_B=INV_STS_D2 PSGNDA=GND_IN_PS PSGNDB=GND_IN_PS SH_GND=SH_GND_INV_1 VDDA=NetCON10A_13A VDDB=NetCON10A_13B VPSA=NetCON10A_12A VPSB=NetCON10A_12B
U_PicoZed/U_DriveInterface/U_InverterConnectors/InverterConnector2AB: designators end in B; ports INV_STS_A_A=INV_STS_A3 INV_STS_A_B=INV_STS_A4 INV_STS_B_A=INV_STS_B3 INV_STS_B_B=INV_STS_B4 INV_STS_C_A=INV_STS_C3 INV_STS_C_B=INV_STS_C4 INV_STS_D_A=INV_STS_D3 INV_STS_D_B=INV_STS_D4 PSGNDA=GND_IN_PS PSGNDB=GND_IN_PS SH_GND=SH_GND_INV_2 VDDA=NetCON10B_13A VDDB=NetCON10B_13B VPSA=NetCON10B_12A VPSB=NetCON10B_12B
U_PicoZed/U_DriveInterface/U_InverterConnectors/InverterConnector3AB: designators end in C; ports INV_STS_A_A=INV_STS_A5 INV_STS_A_B=INV_STS_A6 INV_STS_B_A=INV_STS_B5 INV_STS_B_B=INV_STS_B6 INV_STS_C_A=INV_STS_C5 INV_STS_C_B=INV_STS_C6 INV_STS_D_A=INV_STS_D5 INV_STS_D_B=INV_STS_D6 PSGNDA=GND_IN_PS PSGNDB=GND_IN_PS SH_GND=SH_GND_INV_3 VDDA=NetCON10C_13A VDDB=NetCON10C_13B VPSA=NetCON10C_12A VPSB=NetCON10C_12B
U_PicoZed/U_DriveInterface/U_InverterConnectors/InverterConnector4AB: designators end in D; ports INV_STS_A_A=INV_STS_A7 INV_STS_A_B=INV_STS_A8 INV_STS_B_A=INV_STS_B7 INV_STS_B_B=INV_STS_B8 INV_STS_C_A=INV_STS_C7 INV_STS_C_B=INV_STS_C8 INV_STS_D_A=INV_STS_D7 INV_STS_D_B=INV_STS_D8 PSGNDA=GND_IN_PS PSGNDB=GND_IN_PS SH_GND=SH_GND_INV_4 VDDA=NetCON10D_13A VDDB=NetCON10D_13B VPSA=NetCON10D_12A VPSB=NetCON10D_12B

### Buses and harness runs
bus INV_PWM_A[1..6] = port INV_PWM_A[1..6]
bus INV_PWM_B[1..6] = port INV_PWM_B[1..6]

### Notes on the sheet
- Short Circuit Protection
- Title:
- File:
- Sheet:
- of
- Revision:
- Time:
- Date:
- Engineer:
- (in symbol 0ZCM0004FF2G) +T°

### Library data of the parts
CON10 = 178-H15-513R577: CONN D-SUB PLUG 15POS R/A SLDR; Supplier 1: Digi-Key; Supplier Part Number 1: NOR1831-ND
RT1-RT12 = 0ZCM0004FF2G: PTC RESET FUSE 24V 40MA 0603; Supplier 1: Digi-Key; Supplier Part Number 1: 507-0ZCM0004FF2GCT-ND
R17 R93-R96 = Resistor: Supplier 1: Digi-Key; Supplier Part Number 1: 311-0.0ERCT-ND

## Sheet InverterTranslation.SchDoc: Inverter Level Translation
size Letter; Engineer: Nathan Petersen; DocumentNumber: 13; Revision: v1.2; SheetNumber: 13; SheetTotal: 23
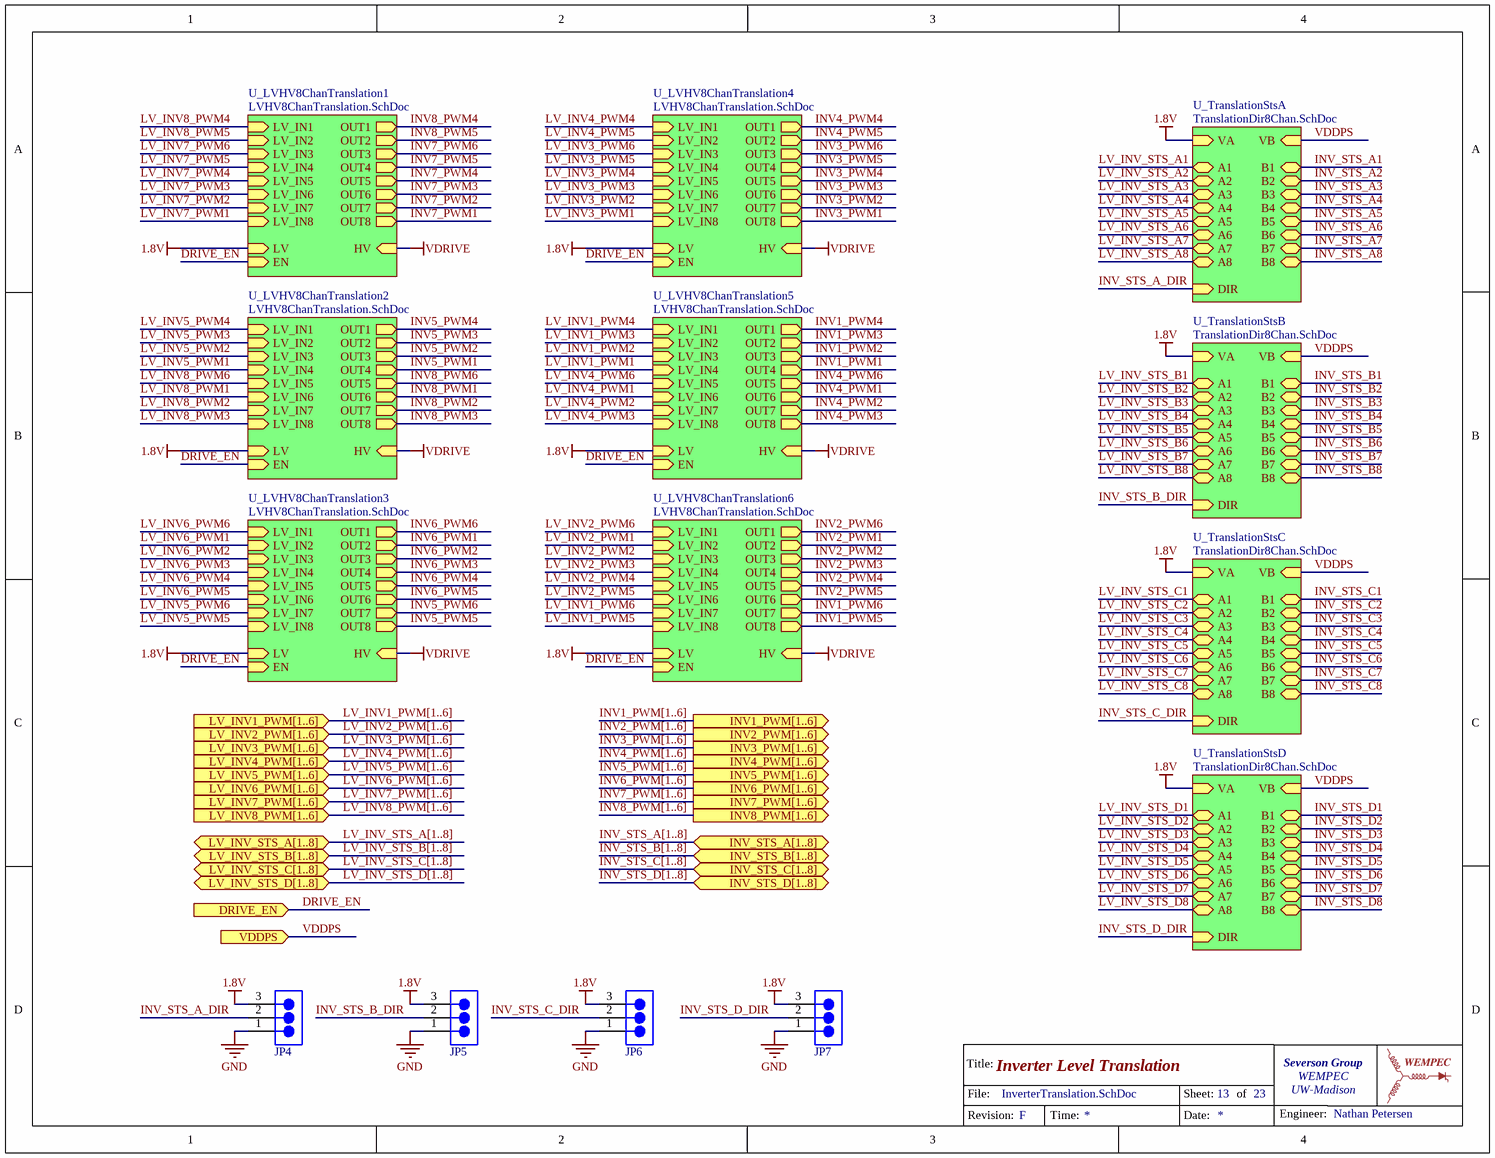
[diagram p5: InverterTranslation.SchDoc]

### Parts
JP4  Jumper3  [PIN_HEADER_1X3]  (value not drawn)
JP5  Jumper3  [PIN_HEADER_1X3]  (value not drawn)
JP6  Jumper3  [PIN_HEADER_1X3]  (value not drawn)
JP7  Jumper3  [PIN_HEADER_1X3]  (value not drawn)

### Sub-sheets
U_LVHV8ChanTranslation1 = LVHV8ChanTranslation.SchDoc: LV_IN1 (in), LV (in), HV (in), EN (in), OUT1 (out), OUT2 (out), OUT3 (out), OUT4 (out), LV_IN2 (in), LV_IN3 (in), LV_IN4 (in), LV_IN5 (in), LV_IN6 (in), LV_IN7 (in), LV_IN8 (in), OUT5 (out), OUT6 (out), OUT7 (out), OUT8 (out)
U_LVHV8ChanTranslation2 = LVHV8ChanTranslation.SchDoc: LV_IN1 (in), LV (in), HV (in), EN (in), OUT1 (out), OUT2 (out), OUT3 (out), OUT4 (out), LV_IN2 (in), LV_IN3 (in), LV_IN4 (in), LV_IN5 (in), LV_IN6 (in), LV_IN7 (in), LV_IN8 (in), OUT5 (out), OUT6 (out), OUT7 (out), OUT8 (out)
U_LVHV8ChanTranslation3 = LVHV8ChanTranslation.SchDoc: LV_IN1 (in), LV (in), HV (in), EN (in), OUT1 (out), OUT2 (out), OUT3 (out), OUT4 (out), LV_IN2 (in), LV_IN3 (in), LV_IN4 (in), LV_IN5 (in), LV_IN6 (in), LV_IN7 (in), LV_IN8 (in), OUT5 (out), OUT6 (out), OUT7 (out), OUT8 (out)
U_LVHV8ChanTranslation4 = LVHV8ChanTranslation.SchDoc: LV_IN1 (in), LV (in), HV (in), EN (in), OUT1 (out), OUT2 (out), OUT3 (out), OUT4 (out), LV_IN2 (in), LV_IN3 (in), LV_IN4 (in), LV_IN5 (in), LV_IN6 (in), LV_IN7 (in), LV_IN8 (in), OUT5 (out), OUT6 (out), OUT7 (out), OUT8 (out)
U_LVHV8ChanTranslation5 = LVHV8ChanTranslation.SchDoc: LV_IN1 (in), LV (in), HV (in), EN (in), OUT1 (out), OUT2 (out), OUT3 (out), OUT4 (out), LV_IN2 (in), LV_IN3 (in), LV_IN4 (in), LV_IN5 (in), LV_IN6 (in), LV_IN7 (in), LV_IN8 (in), OUT5 (out), OUT6 (out), OUT7 (out), OUT8 (out)
U_LVHV8ChanTranslation6 = LVHV8ChanTranslation.SchDoc: LV_IN1 (in), LV (in), HV (in), EN (in), OUT1 (out), OUT2 (out), OUT3 (out), OUT4 (out), LV_IN2 (in), LV_IN3 (in), LV_IN4 (in), LV_IN5 (in), LV_IN6 (in), LV_IN7 (in), LV_IN8 (in), OUT5 (out), OUT6 (out), OUT7 (out), OUT8 (out)
U_TranslationStsA = TranslationDir8Chan.SchDoc: VB (in), VA (in), B1 (bidir), B2 (bidir), B3 (bidir), B4 (bidir), B5 (bidir), B6 (bidir), B7 (bidir), B8 (bidir), A1 (bidir), A2 (bidir), A3 (bidir), A4 (bidir), A5 (bidir), A6 (bidir), A7 (bidir), A8 (bidir), DIR (in)
U_TranslationStsB = TranslationDir8Chan.SchDoc: VB (in), VA (in), B1 (bidir), B2 (bidir), B3 (bidir), B4 (bidir), B5 (bidir), B6 (bidir), B7 (bidir), B8 (bidir), A1 (bidir), A2 (bidir), A3 (bidir), A4 (bidir), A5 (bidir), A6 (bidir), A7 (bidir), A8 (bidir), DIR (in)
U_TranslationStsC = TranslationDir8Chan.SchDoc: VB (in), VA (in), B1 (bidir), B2 (bidir), B3 (bidir), B4 (bidir), B5 (bidir), B6 (bidir), B7 (bidir), B8 (bidir), A1 (bidir), A2 (bidir), A3 (bidir), A4 (bidir), A5 (bidir), A6 (bidir), A7 (bidir), A8 (bidir), DIR (in)
U_TranslationStsD = TranslationDir8Chan.SchDoc: VB (in), VA (in), B1 (bidir), B2 (bidir), B3 (bidir), B4 (bidir), B5 (bidir), B6 (bidir), B7 (bidir), B8 (bidir), A1 (bidir), A2 (bidir), A3 (bidir), A4 (bidir), A5 (bidir), A6 (bidir), A7 (bidir), A8 (bidir), DIR (in)

### Ports
DRIVE_EN (in), INV1_PWM[1..6] (out), INV2_PWM[1..6] (out), INV3_PWM[1..6] (out), INV4_PWM[1..6] (out), INV5_PWM[1..6] (out), INV6_PWM[1..6] (out), INV7_PWM[1..6] (out), INV8_PWM[1..6] (out), INV_STS_A[1..8] (bidir), INV_STS_B[1..8] (bidir), INV_STS_C[1..8] (bidir), INV_STS_D[1..8] (bidir), LV_INV1_PWM[1..6] (in), LV_INV2_PWM[1..6] (in), LV_INV3_PWM[1..6] (in), LV_INV4_PWM[1..6] (in), LV_INV5_PWM[1..6] (in), LV_INV6_PWM[1..6] (in), LV_INV7_PWM[1..6] (in), LV_INV8_PWM[1..6] (in), LV_INV_STS_A[1..8] (bidir), LV_INV_STS_B[1..8] (bidir), LV_INV_STS_C[1..8] (bidir), LV_INV_STS_D[1..8] (bidir), VDDPS (in)

### Nets
1.8V: JP4.3 JP5.3 JP6.3 JP7.3 ; sheet U_LVHV8ChanTranslation1/LV, sheet U_LVHV8ChanTranslation2/LV, sheet U_LVHV8ChanTranslation3/LV, sheet U_LVHV8ChanTranslation4/LV, sheet U_LVHV8ChanTranslation5/LV, sheet U_LVHV8ChanTranslation6/LV, sheet U_TranslationStsA/VA, sheet U_TranslationStsB/VA, sheet U_TranslationStsC/VA, sheet U_TranslationStsD/VA
GND: JP4.1 JP5.1 JP6.1 JP7.1
VDRIVE: sheet U_LVHV8ChanTranslation1/HV, sheet U_LVHV8ChanTranslation2/HV, sheet U_LVHV8ChanTranslation3/HV, sheet U_LVHV8ChanTranslation4/HV, sheet U_LVHV8ChanTranslation5/HV, sheet U_LVHV8ChanTranslation6/HV
DRIVE_EN: port DRIVE_EN, sheet U_LVHV8ChanTranslation1/EN, sheet U_LVHV8ChanTranslation2/EN, sheet U_LVHV8ChanTranslation3/EN, sheet U_LVHV8ChanTranslation4/EN, sheet U_LVHV8ChanTranslation5/EN, sheet U_LVHV8ChanTranslation6/EN
INV_STS_A_DIR: JP4.2 ; sheet U_TranslationStsA/DIR
INV_STS_B_DIR: JP5.2 ; sheet U_TranslationStsB/DIR
INV_STS_C_DIR: JP6.2 ; sheet U_TranslationStsC/DIR
INV_STS_D_DIR: JP7.2 ; sheet U_TranslationStsD/DIR
VDDPS: port VDDPS, sheet U_TranslationStsA/VB, sheet U_TranslationStsB/VB, sheet U_TranslationStsC/VB, sheet U_TranslationStsD/VB

### Buses and harness runs
bus INV1_PWM[1..6] = port INV1_PWM[1..6]
bus INV2_PWM[1..6] = port INV2_PWM[1..6]
bus INV3_PWM[1..6] = port INV3_PWM[1..6]
bus INV4_PWM[1..6] = port INV4_PWM[1..6]
bus INV5_PWM[1..6] = port INV5_PWM[1..6]
bus INV6_PWM[1..6] = port INV6_PWM[1..6]
bus INV7_PWM[1..6] = port INV7_PWM[1..6]
bus INV8_PWM[1..6] = port INV8_PWM[1..6]
bus INV_STS_A[1..8] = port INV_STS_A[1..8]
bus INV_STS_B[1..8] = port INV_STS_B[1..8]
bus INV_STS_C[1..8] = port INV_STS_C[1..8]
bus INV_STS_D[1..8] = port INV_STS_D[1..8]
bus LV_INV1_PWM[1..6] = port LV_INV1_PWM[1..6]
bus LV_INV2_PWM[1..6] = port LV_INV2_PWM[1..6]
bus LV_INV3_PWM[1..6] = port LV_INV3_PWM[1..6]
bus LV_INV4_PWM[1..6] = port LV_INV4_PWM[1..6]
bus LV_INV5_PWM[1..6] = port LV_INV5_PWM[1..6]
bus LV_INV6_PWM[1..6] = port LV_INV6_PWM[1..6]
bus LV_INV7_PWM[1..6] = port LV_INV7_PWM[1..6]
bus LV_INV8_PWM[1..6] = port LV_INV8_PWM[1..6]
bus LV_INV_STS_A[1..8] = port LV_INV_STS_A[1..8]
bus LV_INV_STS_B[1..8] = port LV_INV_STS_B[1..8]
bus LV_INV_STS_C[1..8] = port LV_INV_STS_C[1..8]
bus LV_INV_STS_D[1..8] = port LV_INV_STS_D[1..8]

### Notes on the sheet
- Title:
- File:
- Sheet:
- of
- Revision:
- Time:
- Date:
- Engineer:

### Library data of the parts
JP4-JP7 = Jumper3: Supplier 1: Digi-Key; Supplier Part Number 1: 732-5316-ND

## Sheet LVHV8ChanTranslation.SchDoc: 8-channel LV to HV Translation
size Letter; Engineer: Nathan Petersen; DocumentNumber: 14; Revision: v1.2; SheetNumber: 14; SheetTotal: 23
Used 6 times, as channels U_PicoZed/U_DriveInterface/U_InverterTranslation/U_LVHV8ChanTranslation1, U_PicoZed/U_DriveInterface/U_InverterTranslation/U_LVHV8ChanTranslation2, U_PicoZed/U_DriveInterface/U_InverterTranslation/U_LVHV8ChanTranslation3, U_PicoZed/U_DriveInterface/U_InverterTranslation/U_LVHV8ChanTranslation4, U_PicoZed/U_DriveInterface/U_InverterTranslation/U_LVHV8ChanTranslation5, U_PicoZed/U_DriveInterface/U_InverterTranslation/U_LVHV8ChanTranslation6. Parts and nets are listed once, with the designators drawn on the sheet.
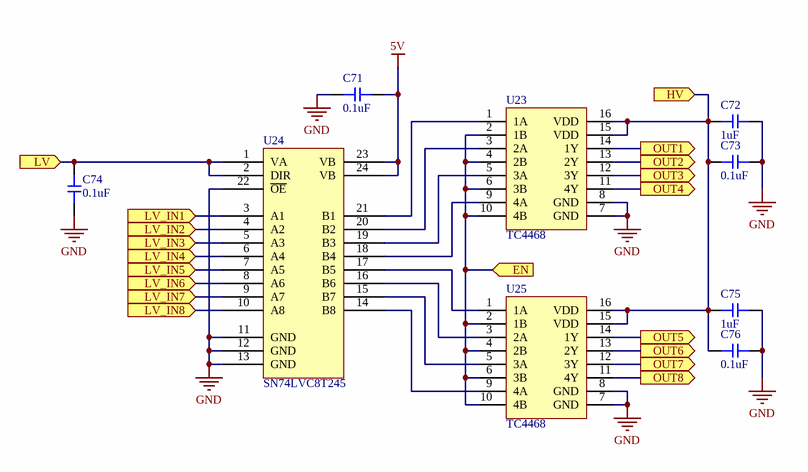
[diagram p6: LVHV8ChanTranslation.SchDoc]

### Parts
C71  value 0.1uF  [0603-CAP]  (hidden comment: Capacitor)
C72  value 1uF  [0603-CAP]  (hidden comment: Capacitor)
C73  value 0.1uF  [0603-CAP]  (hidden comment: Capacitor)
C74  value 0.1uF  [0603-CAP]  (hidden comment: Capacitor)
C75  value 1uF  [0603-CAP]  (hidden comment: Capacitor)
C76  value 0.1uF  [0603-CAP]  (hidden comment: Capacitor)
U23  TC4468  [SOIC16_N - wide]
U24  SN74LVC8T245  [TSOP65P640X120-24N]
U25  TC4468  [SOIC16_N - wide]

### Ports
EN (in), HV (in), LV (in), LV_IN1 (in), LV_IN2 (in), LV_IN3 (in), LV_IN4 (in), LV_IN5 (in), LV_IN6 (in), LV_IN7 (in), LV_IN8 (in), OUT1 (out), OUT2 (out), OUT3 (out), OUT4 (out), OUT5 (out), OUT6 (out), OUT7 (out), OUT8 (out)

### Nets
5V: C71.1 U24.23(VB) U24.24(VB)
GND: C71.2 C72.2 C73.2 C74.1 C75.2 C76.2 U23.7(GND) U23.8(GND) U24.11(GND) U24.12(GND) U24.13(GND) U24.22(~{OE}) U25.7(GND) U25.8(GND)
EN: U23.2(1B) U23.4(2B) U23.6(3B) U23.10(4B) U25.2(1B) U25.4(2B) U25.6(3B) U25.10(4B) ; port EN
HV: C72.1 C73.1 C75.1 C76.1 U23.15(VDD) U23.16(VDD) U25.15(VDD) U25.16(VDD) ; port HV
LV: C74.2 U24.1(VA) U24.2(DIR) ; port LV
LV_IN1: U24.3(A1) ; port LV_IN1
LV_IN2: U24.4(A2) ; port LV_IN2
LV_IN3: U24.5(A3) ; port LV_IN3
LV_IN4: U24.6(A4) ; port LV_IN4
LV_IN5: U24.7(A5) ; port LV_IN5
LV_IN6: U24.8(A6) ; port LV_IN6
LV_IN7: U24.9(A7) ; port LV_IN7
LV_IN8: U24.10(A8) ; port LV_IN8
OUT1: U23.14(1Y) ; port OUT1
OUT2: U23.13(2Y) ; port OUT2
OUT3: U23.12(3Y) ; port OUT3
OUT4: U23.11(4Y) ; port OUT4
OUT5: U25.14(1Y) ; port OUT5
OUT6: U25.13(2Y) ; port OUT6
OUT7: U25.12(3Y) ; port OUT7
OUT8: U25.11(4Y) ; port OUT8
NetU23_1: U23.1(1A) U24.21(B1)
NetU23_3: U23.3(2A) U24.20(B2)
NetU23_5: U23.5(3A) U24.19(B3)
NetU23_9: U23.9(4A) U24.18(B4)
NetU24_14: U24.14(B8) U25.9(4A)
NetU24_15: U24.15(B7) U25.5(3A)
NetU24_16: U24.16(B6) U25.3(2A)
NetU24_17: U24.17(B5) U25.1(1A)

### Channels
U_PicoZed/U_DriveInterface/U_InverterTranslation/U_LVHV8ChanTranslation1: designators end in A; ports EN=DRIVE_EN HV=VDRIVE LV=1.8V LV_IN1=LV_INV8_PWM4 LV_IN2=LV_INV8_PWM5 LV_IN3=LV_INV7_PWM6 LV_IN4=LV_INV7_PWM5 LV_IN5=LV_INV7_PWM4 LV_IN6=LV_INV7_PWM3 LV_IN7=LV_INV7_PWM2 LV_IN8=LV_INV7_PWM1 OUT1=INV8_PWM4 OUT2=INV8_PWM5 OUT3=INV7_PWM6 OUT4=INV7_PWM5 OUT5=INV7_PWM4 OUT6=INV7_PWM3 OUT7=INV7_PWM2 OUT8=INV7_PWM1
U_PicoZed/U_DriveInterface/U_InverterTranslation/U_LVHV8ChanTranslation2: designators end in B; ports EN=DRIVE_EN HV=VDRIVE LV=1.8V LV_IN1=LV_INV5_PWM4 LV_IN2=LV_INV5_PWM3 LV_IN3=LV_INV5_PWM2 LV_IN4=LV_INV5_PWM1 LV_IN5=LV_INV8_PWM6 LV_IN6=LV_INV8_PWM1 LV_IN7=LV_INV8_PWM2 LV_IN8=LV_INV8_PWM3 OUT1=INV5_PWM4 OUT2=INV5_PWM3 OUT3=INV5_PWM2 OUT4=INV5_PWM1 OUT5=INV8_PWM6 OUT6=INV8_PWM1 OUT7=INV8_PWM2 OUT8=INV8_PWM3
U_PicoZed/U_DriveInterface/U_InverterTranslation/U_LVHV8ChanTranslation3: designators end in C; ports EN=DRIVE_EN HV=VDRIVE LV=1.8V LV_IN1=LV_INV6_PWM6 LV_IN2=LV_INV6_PWM1 LV_IN3=LV_INV6_PWM2 LV_IN4=LV_INV6_PWM3 LV_IN5=LV_INV6_PWM4 LV_IN6=LV_INV6_PWM5 LV_IN7=LV_INV5_PWM6 LV_IN8=LV_INV5_PWM5 OUT1=INV6_PWM6 OUT2=INV6_PWM1 OUT3=INV6_PWM2 OUT4=INV6_PWM3 OUT5=INV6_PWM4 OUT6=INV6_PWM5 OUT7=INV5_PWM6 OUT8=INV5_PWM5
U_PicoZed/U_DriveInterface/U_InverterTranslation/U_LVHV8ChanTranslation4: designators end in D; ports EN=DRIVE_EN HV=VDRIVE LV=1.8V LV_IN1=LV_INV4_PWM4 LV_IN2=LV_INV4_PWM5 LV_IN3=LV_INV3_PWM6 LV_IN4=LV_INV3_PWM5 LV_IN5=LV_INV3_PWM4 LV_IN6=LV_INV3_PWM3 LV_IN7=LV_INV3_PWM2 LV_IN8=LV_INV3_PWM1 OUT1=INV4_PWM4 OUT2=INV4_PWM5 OUT3=INV3_PWM6 OUT4=INV3_PWM5 OUT5=INV3_PWM4 OUT6=INV3_PWM3 OUT7=INV3_PWM2 OUT8=INV3_PWM1
U_PicoZed/U_DriveInterface/U_InverterTranslation/U_LVHV8ChanTranslation5: designators end in E; ports EN=DRIVE_EN HV=VDRIVE LV=1.8V LV_IN1=LV_INV1_PWM4 LV_IN2=LV_INV1_PWM3 LV_IN3=LV_INV1_PWM2 LV_IN4=LV_INV1_PWM1 LV_IN5=LV_INV4_PWM6 LV_IN6=LV_INV4_PWM1 LV_IN7=LV_INV4_PWM2 LV_IN8=LV_INV4_PWM3 OUT1=INV1_PWM4 OUT2=INV1_PWM3 OUT3=INV1_PWM2 OUT4=INV1_PWM1 OUT5=INV4_PWM6 OUT6=INV4_PWM1 OUT7=INV4_PWM2 OUT8=INV4_PWM3
U_PicoZed/U_DriveInterface/U_InverterTranslation/U_LVHV8ChanTranslation6: designators end in F; ports EN=DRIVE_EN HV=VDRIVE LV=1.8V LV_IN1=LV_INV2_PWM6 LV_IN2=LV_INV2_PWM1 LV_IN3=LV_INV2_PWM2 LV_IN4=LV_INV2_PWM3 LV_IN5=LV_INV2_PWM4 LV_IN6=LV_INV2_PWM5 LV_IN7=LV_INV1_PWM6 LV_IN8=LV_INV1_PWM5 OUT1=INV2_PWM6 OUT2=INV2_PWM1 OUT3=INV2_PWM2 OUT4=INV2_PWM3 OUT5=INV2_PWM4 OUT6=INV2_PWM5 OUT7=INV1_PWM6 OUT8=INV1_PWM5

### Notes on the sheet
- Title:
- File:
- Sheet:
- of
- Revision:
- Time:
- Date:
- Engineer:

### Library data of the parts
U23 U25 = TC4468: IC MOSFET DVR QUAD AND 16SOIC; Supplier 1: Digi-Key; Supplier Part Number 1: TC4468COE-ND
U24 = SN74LVC8T245PWR: IC BUS TRANSCVR 8BIT 24TSSOP; Supplier 1: Digi-Key; Supplier Part Number 1: 296-18593-1-ND
C71-C76 = Capacitor: Supplier 1: Digi-Key
  C71 C73 C74 C76: Supplier Part Number 1: 1276-1012-6-ND
  C72 C75: Supplier Part Number 1: 1276-6524-6-ND